# EasyEDA Pro project pickle_risc.epro, board PCB1
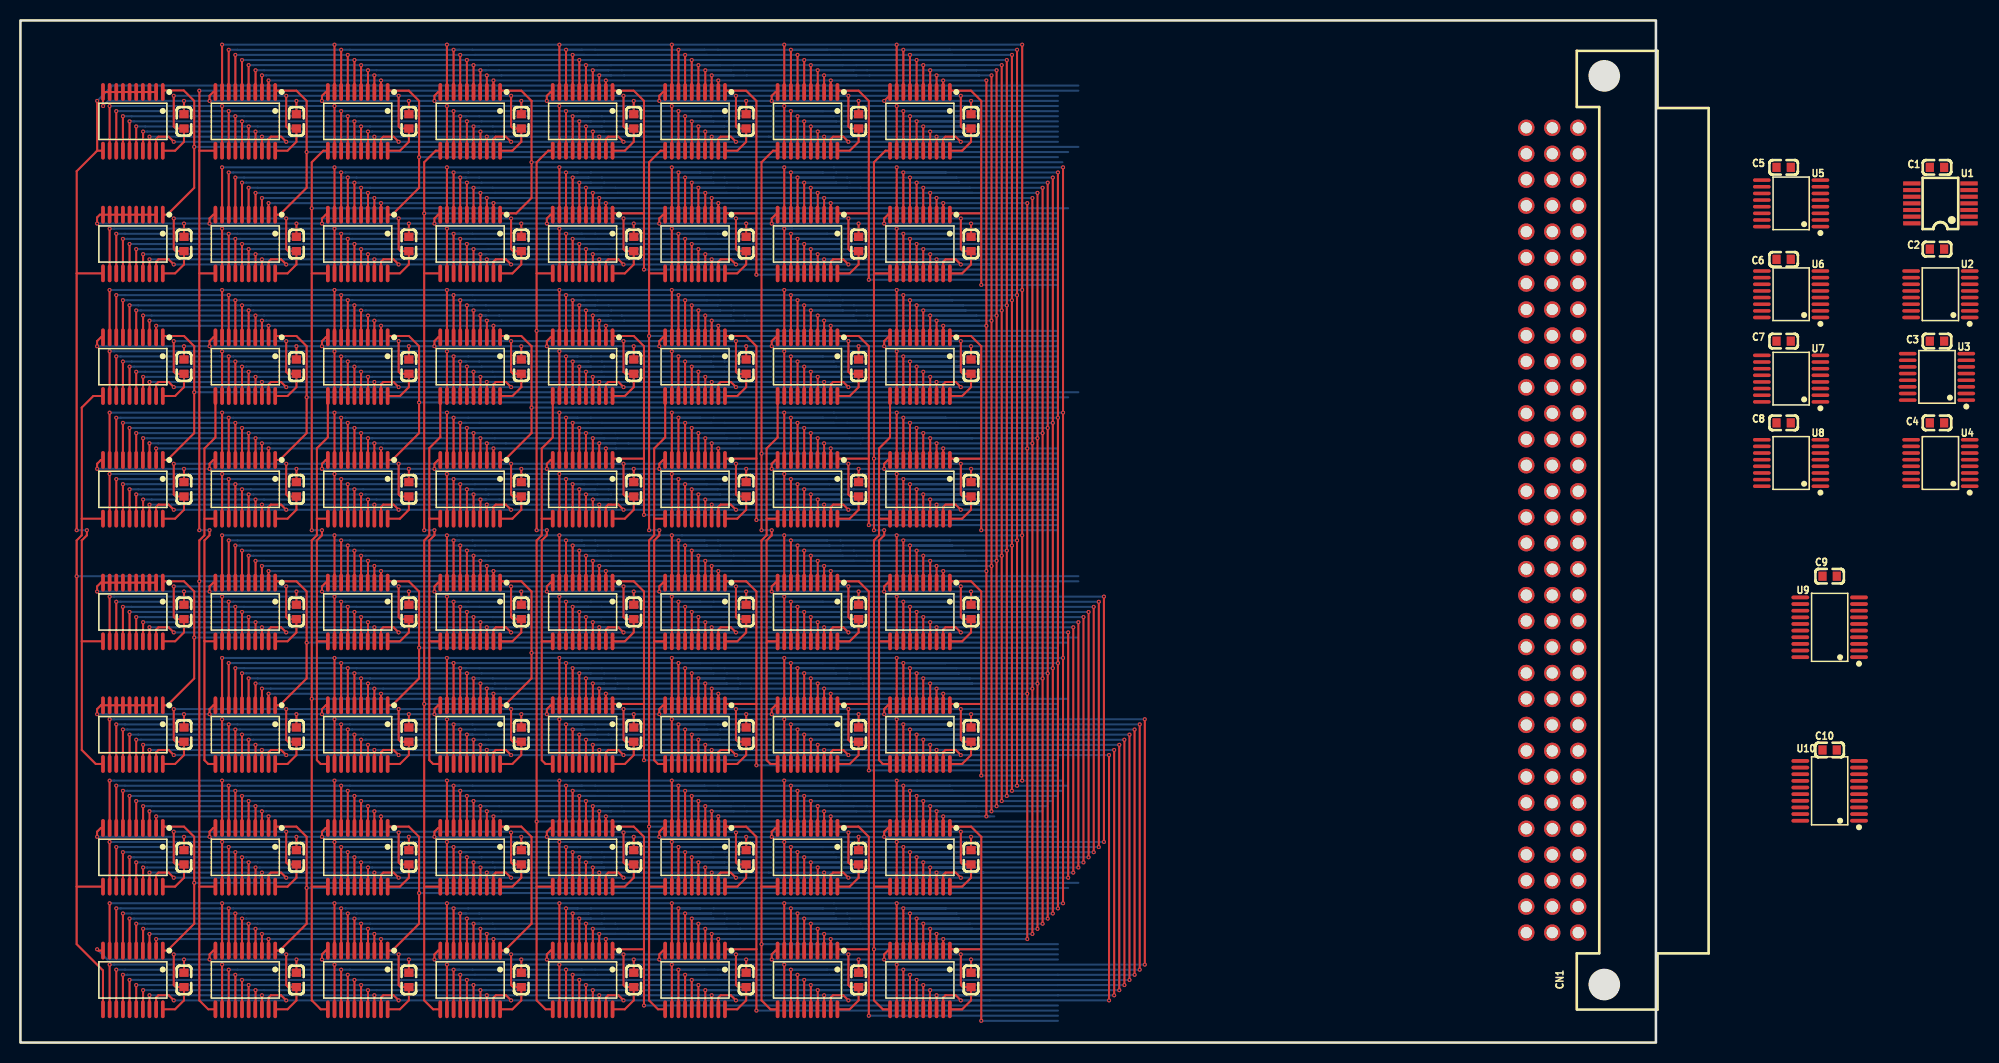
[diagram p1: board, top side]
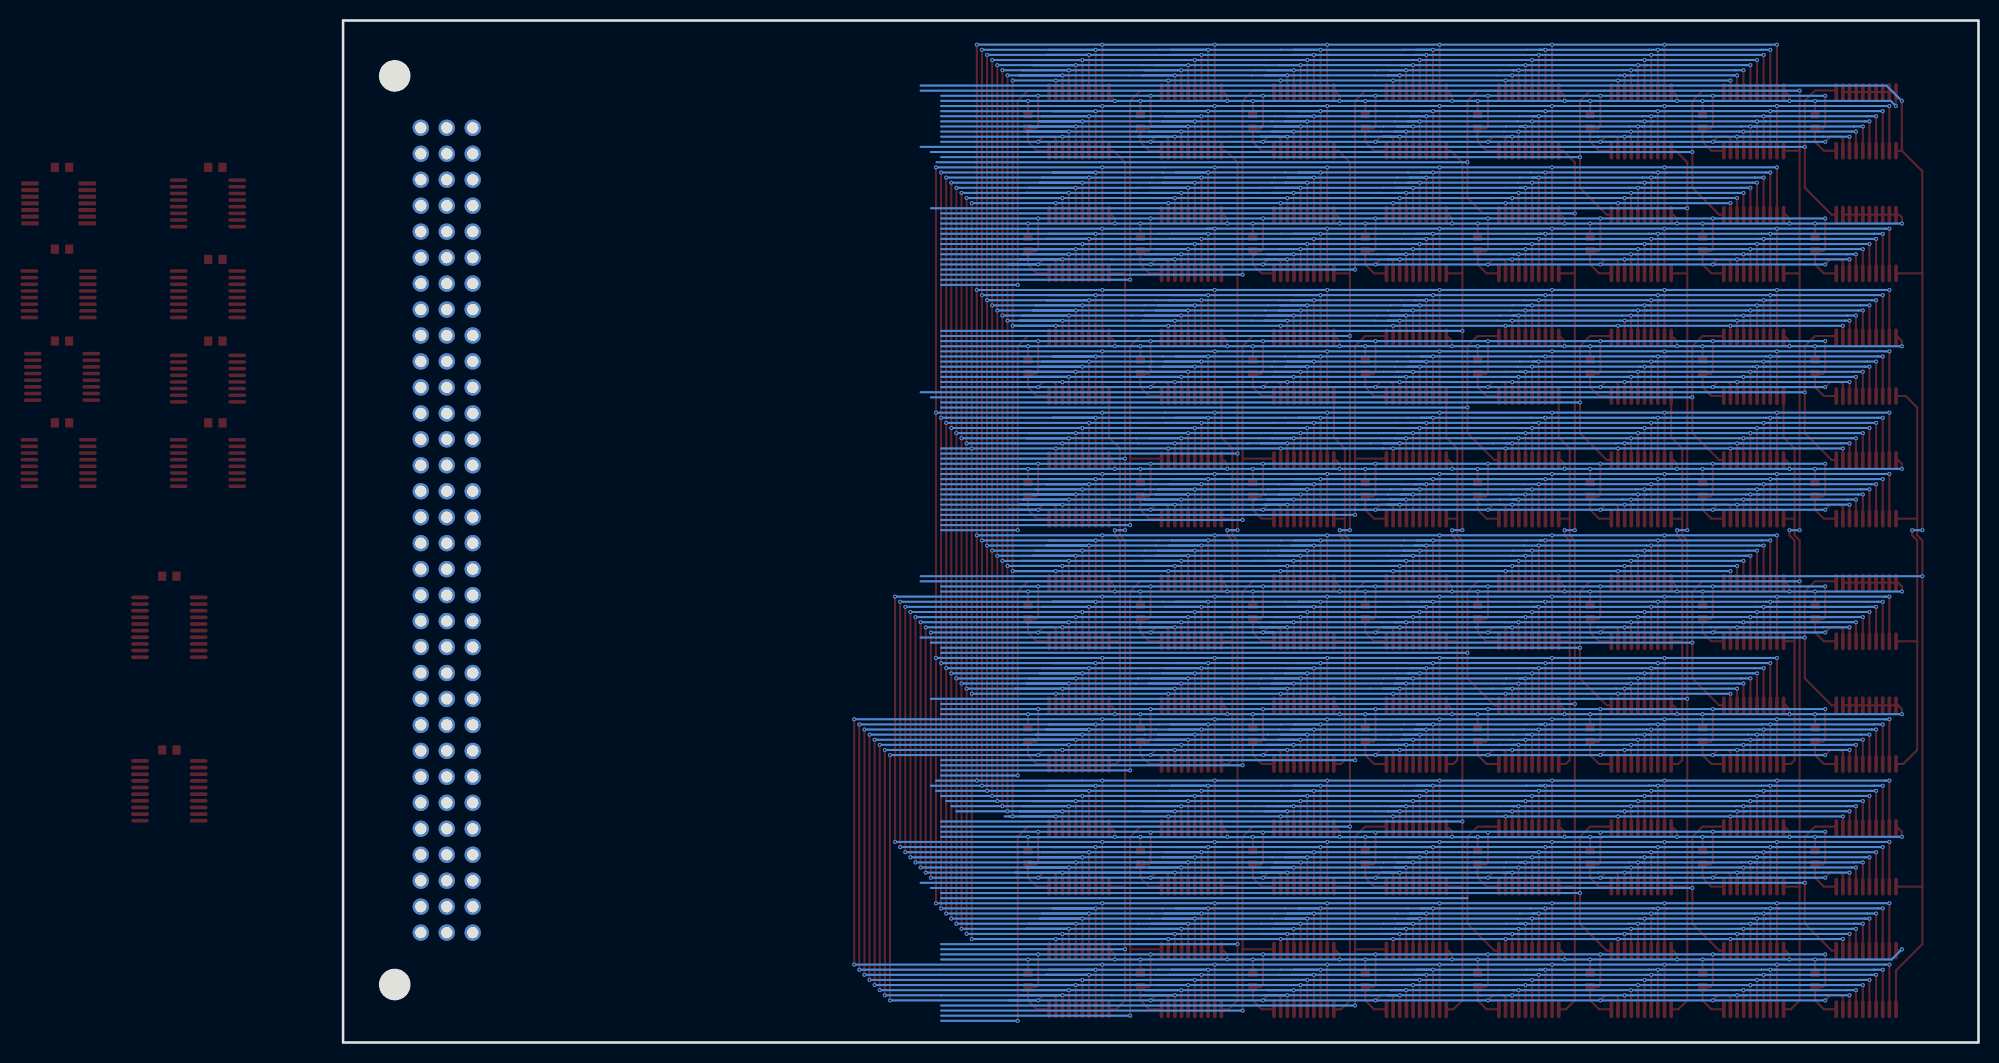
[diagram p2: board, bottom side, seen from below]

Outline 160 x 100 mm; copper layers: Top Layer, Inner1, Inner2, Inner3, Inner4, Inner5, Inner6, Inner7, Inner8, Inner9, Inner10, Inner11, Inner12, Inner13, Inner14, Inner15, Inner16, Inner17, Inner18, Inner19, Inner20, Inner21, Inner22, Inner23, Inner24, Inner25, Inner26, Inner27, Inner28, Inner29, Inner30, Bottom Layer. Coordinates in mm from the lower left corner of the outline.
Outline path: rectangle 0,100 160,0
Stack: Top Layer 0.035mm / Dielectric1 1.51mm FR4 er 4.5 / Bottom Layer 0.035mm

## Design rules (mm)
template: Custom Config
spacing copperThickness1oz (default): track to track 0.102, other pairs 0.152 to 0.3
spacing copperThickness2oz: track to track 0.203, other pairs 0.152 to 0.3
track width copperThickness1oz (default): min 0.127, default 0.2, max 2.54
track width copperThickness2oz: min 0.2, default 0.2, max 2.54
differential pair differentialPair (default): width min 0.127, default 0.254, max 2.54; gap min 0.152, default 0.152
via viaSize (default): diameter min 0.4, default 0.4, max 10; hole min 0.2, default 0.2, max 6.3

## Placement (name value [footprint] x y rotation side)
C1  100nF  [C0603]  187.5 85.63 0 top
C2  100nF  [C0603]  187.5 77.63 0 top
C3  100nF  [C0603]  187.5 68.63 0 top
C4  100nF  [C0603]  187.5 60.63 0 top
C5  100nF  [C0603]  172.5 85.63 180 top
C6  100nF  [C0603]  172.5 76.63 0 top
C7  100nF  [C0603]  172.5 68.63 0 top
C8  100nF  [C0603]  172.5 60.63 0 top
C9  100nF  [C0603]  177 45.63 0 top
C10  100nF  [C0603]  177 28.63 0 top
C13  100nF  [C0603]  27 90.13 90 top
C14  100nF  [C0603]  60 90.13 90 top
C15  100nF  [C0603]  38 90.13 90 top
C16  100nF  [C0603]  49 90.13 90 top
C17  100nF  [C0603]  38 42.13 90 top
C18  100nF  [C0603]  27 30.13 90 top
C19  100nF  [C0603]  27 42.13 90 top
C20  100nF  [C0603]  38 78.13 90 top
C25  100nF  [C0603]  49 30.13 90 top
C26  100nF  [C0603]  49 42.13 90 top
C27  100nF  [C0603]  60 78.13 90 top
C28  100nF  [C0603]  27 78.13 90 top
C29  100nF  [C0603]  60 30.13 90 top
C30  100nF  [C0603]  60 42.13 90 top
C31  100nF  [C0603]  71 78.13 90 top
C32  100nF  [C0603]  71 90.13 90 top
C33  100nF  [C0603]  71 30.13 90 top
C34  100nF  [C0603]  71 42.13 90 top
C35  100nF  [C0603]  82 78.13 90 top
C36  100nF  [C0603]  82 90.13 90 top
C37  100nF  [C0603]  82 30.13 90 top
C38  100nF  [C0603]  82 42.13 90 top
C39  100nF  [C0603]  93 78.13 90 top
C40  100nF  [C0603]  93 90.13 90 top
C41  100nF  [C0603]  93 30.13 90 top
C42  100nF  [C0603]  93 42.13 90 top
C43  100nF  [C0603]  16 54.13 90 top
C44  100nF  [C0603]  16 66.13 90 top
C45  100nF  [C0603]  16 6.13 90 top
C46  100nF  [C0603]  16 18.13 90 top
C47  100nF  [C0603]  27 54.13 90 top
C48  100nF  [C0603]  27 66.13 90 top
C49  100nF  [C0603]  27 6.13 90 top
C50  100nF  [C0603]  27 18.13 90 top
C51  100nF  [C0603]  38 54.13 90 top
C52  100nF  [C0603]  38 66.13 90 top
C53  100nF  [C0603]  38 6.13 90 top
C54  100nF  [C0603]  38 18.13 90 top
C55  100nF  [C0603]  49 54.13 90 top
C56  100nF  [C0603]  49 66.13 90 top
C57  100nF  [C0603]  49 6.13 90 top
C58  100nF  [C0603]  49 18.13 90 top
C59  100nF  [C0603]  60 54.13 90 top
C60  100nF  [C0603]  60 66.13 90 top
C61  100nF  [C0603]  60 6.13 90 top
C62  100nF  [C0603]  60 18.13 90 top
C63  100nF  [C0603]  71 54.13 90 top
C64  100nF  [C0603]  71 66.13 90 top
C65  100nF  [C0603]  71 6.13 90 top
C66  100nF  [C0603]  71 18.13 90 top
C67  100nF  [C0603]  82 54.13 90 top
C68  100nF  [C0603]  82 66.13 90 top
C69  100nF  [C0603]  82 6.13 90 top
C70  100nF  [C0603]  82 18.13 90 top
C71  100nF  [C0603]  93 54.13 90 top
C72  100nF  [C0603]  93 66.13 90 top
C73  100nF  [C0603]  93 6.13 90 top
C74  100nF  [C0603]  93 18.13 90 top
C75  100nF  [C0603]  16 78.13 90 top
C76  100nF  [C0603]  16 90.13 90 top
C77  100nF  [C0603]  16 30.13 90 top
C78  100nF  [C0603]  16 42.13 90 top
C79  100nF  [C0603]  38 30.13 90 top
C80  100nF  [C0603]  49 78.13 90 top
CN1  3511396AMRS0BNA1  [CONN-TH_3511396AMRS0BNA1]  149.86 50.13 90 top
U1  74HC00T14-13  [TSSOP-14_L5.0-W4.4-P0.65-LS6.4-BL]  187.83 82.1 90 top
U2  SN74HC157PWR  [TSSOP-16_L5.0-W4.4-P0.65-LS6.4-BL]  187.83 73.21 90 top
U3  SN74HC138PWR  [TSSOP-16_L5.0-W4.4-P0.65-LS6.4-BL]  187.5 65.13 90 top
U4  SN74HC138PWR  [TSSOP-16_L5.0-W4.4-P0.65-LS6.4-BL]  187.83 56.7 90 top
U5  SN74HC138PWR  [TSSOP-16_L5.0-W4.4-P0.65-LS6.4-BL]  173.23 82.1 90 top
U6  SN74HC138PWR  [TSSOP-16_L5.0-W4.4-P0.65-LS6.4-BL]  173.23 73.21 90 top
U7  SN74HC138PWR  [TSSOP-16_L5.0-W4.4-P0.65-LS6.4-BL]  173.23 64.96 90 top
U8  SN74HC138PWR  [TSSOP-16_L5.0-W4.4-P0.65-LS6.4-BL]  173.23 56.7 90 top
U9  SN74HC574PWR  [TSSOP-20_L6.5-W4.4-P0.65-LS6.4-BL]  177 40.63 90 top
U10  SN74HC574PWR  [TSSOP-20_L6.5-W4.4-P0.65-LS6.4-BL]  177 24.63 90 top
U11  SN74HC574PWR  [TSSOP-20_L6.5-W4.4-P0.65-LS6.4-BL]  55 42.13 180 top
U12  SN74HC574PWR  [TSSOP-20_L6.5-W4.4-P0.65-LS6.4-BL]  66 90.13 180 top
U13  SN74HC574PWR  [TSSOP-20_L6.5-W4.4-P0.65-LS6.4-BL]  22 90.13 180 top
U14  SN74HC574PWR  [TSSOP-20_L6.5-W4.4-P0.65-LS6.4-BL]  55 90.13 180 top
U15  SN74HC574PWR  [TSSOP-20_L6.5-W4.4-P0.65-LS6.4-BL]  33 90.13 180 top
U16  SN74HC574PWR  [TSSOP-20_L6.5-W4.4-P0.65-LS6.4-BL]  44 90.13 180 top
U17  SN74HC574PWR  [TSSOP-20_L6.5-W4.4-P0.65-LS6.4-BL]  22 42.13 180 top
U18  SN74HC574PWR  [TSSOP-20_L6.5-W4.4-P0.65-LS6.4-BL]  22 30.13 180 top
U19  SN74HC574PWR  [TSSOP-20_L6.5-W4.4-P0.65-LS6.4-BL]  77 90.13 180 top
U20  SN74HC574PWR  [TSSOP-20_L6.5-W4.4-P0.65-LS6.4-BL]  88 90.13 180 top
U21  SN74HC574PWR  [TSSOP-20_L6.5-W4.4-P0.65-LS6.4-BL]  33 30.13 180 top
U22  SN74HC574PWR  [TSSOP-20_L6.5-W4.4-P0.65-LS6.4-BL]  33 42.13 180 top
U23  SN74HC574PWR  [TSSOP-20_L6.5-W4.4-P0.65-LS6.4-BL]  33 66.13 180 top
U24  SN74HC574PWR  [TSSOP-20_L6.5-W4.4-P0.65-LS6.4-BL]  44 66.13 180 top
U25  SN74HC574PWR  [TSSOP-20_L6.5-W4.4-P0.65-LS6.4-BL]  44 30.13 180 top
U26  SN74HC574PWR  [TSSOP-20_L6.5-W4.4-P0.65-LS6.4-BL]  44 42.13 180 top
U27  SN74HC574PWR  [TSSOP-20_L6.5-W4.4-P0.65-LS6.4-BL]  77 66.13 180 top
U28  SN74HC574PWR  [TSSOP-20_L6.5-W4.4-P0.65-LS6.4-BL]  88 66.13 180 top
U29  SN74HC574PWR  [TSSOP-20_L6.5-W4.4-P0.65-LS6.4-BL]  55 30.13 180 top
U30  SN74HC574PWR  [TSSOP-20_L6.5-W4.4-P0.65-LS6.4-BL]  22 78.13 180 top
U31  SN74HC574PWR  [TSSOP-20_L6.5-W4.4-P0.65-LS6.4-BL]  33 78.13 180 top
U32  SN74HC574PWR  [TSSOP-20_L6.5-W4.4-P0.65-LS6.4-BL]  44 78.13 180 top
U33  SN74HC574PWR  [TSSOP-20_L6.5-W4.4-P0.65-LS6.4-BL]  55 78.13 180 top
U34  SN74HC574PWR  [TSSOP-20_L6.5-W4.4-P0.65-LS6.4-BL]  66 78.13 180 top
U35  SN74HC574PWR  [TSSOP-20_L6.5-W4.4-P0.65-LS6.4-BL]  77 78.13 180 top
U36  SN74HC574PWR  [TSSOP-20_L6.5-W4.4-P0.65-LS6.4-BL]  88 78.13 180 top
U37  SN74HC574PWR  [TSSOP-20_L6.5-W4.4-P0.65-LS6.4-BL]  77 30.13 180 top
U38  SN74HC574PWR  [TSSOP-20_L6.5-W4.4-P0.65-LS6.4-BL]  77 42.13 180 top
U39  SN74HC574PWR  [TSSOP-20_L6.5-W4.4-P0.65-LS6.4-BL]  33 54.13 180 top
U40  SN74HC574PWR  [TSSOP-20_L6.5-W4.4-P0.65-LS6.4-BL]  44 54.13 180 top
U41  SN74HC574PWR  [TSSOP-20_L6.5-W4.4-P0.65-LS6.4-BL]  88 30.13 180 top
U42  SN74HC574PWR  [TSSOP-20_L6.5-W4.4-P0.65-LS6.4-BL]  88 42.13 180 top
U43  SN74HC574PWR  [TSSOP-20_L6.5-W4.4-P0.65-LS6.4-BL]  77 54.13 180 top
U44  SN74HC574PWR  [TSSOP-20_L6.5-W4.4-P0.65-LS6.4-BL]  88 54.13 180 top
U45  SN74HC574PWR  [TSSOP-20_L6.5-W4.4-P0.65-LS6.4-BL]  11 6.13 180 top
U46  SN74HC574PWR  [TSSOP-20_L6.5-W4.4-P0.65-LS6.4-BL]  11 18.13 180 top
U47  SN74HC574PWR  [TSSOP-20_L6.5-W4.4-P0.65-LS6.4-BL]  66 42.13 180 top
U48  SN74HC574PWR  [TSSOP-20_L6.5-W4.4-P0.65-LS6.4-BL]  66 30.13 180 top
U49  SN74HC574PWR  [TSSOP-20_L6.5-W4.4-P0.65-LS6.4-BL]  22 6.13 180 top
U50  SN74HC574PWR  [TSSOP-20_L6.5-W4.4-P0.65-LS6.4-BL]  22 18.13 180 top
U51  SN74HC574PWR  [TSSOP-20_L6.5-W4.4-P0.65-LS6.4-BL]  11 54.13 180 top
U52  SN74HC574PWR  [TSSOP-20_L6.5-W4.4-P0.65-LS6.4-BL]  11 66.13 180 top
U53  SN74HC574PWR  [TSSOP-20_L6.5-W4.4-P0.65-LS6.4-BL]  33 6.13 180 top
U54  SN74HC574PWR  [TSSOP-20_L6.5-W4.4-P0.65-LS6.4-BL]  33 18.13 180 top
U55  SN74HC574PWR  [TSSOP-20_L6.5-W4.4-P0.65-LS6.4-BL]  22 54.13 180 top
U56  SN74HC574PWR  [TSSOP-20_L6.5-W4.4-P0.65-LS6.4-BL]  22 66.13 180 top
U57  SN74HC574PWR  [TSSOP-20_L6.5-W4.4-P0.65-LS6.4-BL]  44 6.13 180 top
U58  SN74HC574PWR  [TSSOP-20_L6.5-W4.4-P0.65-LS6.4-BL]  44 18.13 180 top
U59  SN74HC574PWR  [TSSOP-20_L6.5-W4.4-P0.65-LS6.4-BL]  55 54.13 180 top
U60  SN74HC574PWR  [TSSOP-20_L6.5-W4.4-P0.65-LS6.4-BL]  55 66.13 180 top
U61  SN74HC574PWR  [TSSOP-20_L6.5-W4.4-P0.65-LS6.4-BL]  55 6.13 180 top
U62  SN74HC574PWR  [TSSOP-20_L6.5-W4.4-P0.65-LS6.4-BL]  55 18.13 180 top
U63  SN74HC574PWR  [TSSOP-20_L6.5-W4.4-P0.65-LS6.4-BL]  66 54.13 180 top
U64  SN74HC574PWR  [TSSOP-20_L6.5-W4.4-P0.65-LS6.4-BL]  66 66.13 180 top
U65  SN74HC574PWR  [TSSOP-20_L6.5-W4.4-P0.65-LS6.4-BL]  66 6.13 180 top
U66  SN74HC574PWR  [TSSOP-20_L6.5-W4.4-P0.65-LS6.4-BL]  66 18.13 180 top
U67  SN74HC574PWR  [TSSOP-20_L6.5-W4.4-P0.65-LS6.4-BL]  11 78.13 180 top
U68  SN74HC574PWR  [TSSOP-20_L6.5-W4.4-P0.65-LS6.4-BL]  11 90.13 180 top
U69  SN74HC574PWR  [TSSOP-20_L6.5-W4.4-P0.65-LS6.4-BL]  77 6.13 180 top
U70  SN74HC574PWR  [TSSOP-20_L6.5-W4.4-P0.65-LS6.4-BL]  77 18.13 180 top
U71  SN74HC574PWR  [TSSOP-20_L6.5-W4.4-P0.65-LS6.4-BL]  11 42.13 180 top
U72  SN74HC574PWR  [TSSOP-20_L6.5-W4.4-P0.65-LS6.4-BL]  11 30.13 180 top
U73  SN74HC574PWR  [TSSOP-20_L6.5-W4.4-P0.65-LS6.4-BL]  88 6.13 180 top
U74  SN74HC574PWR  [TSSOP-20_L6.5-W4.4-P0.65-LS6.4-BL]  88 18.13 180 top

## Footprints (pads in the part's own frame, mm; a bottom-side part is the same pattern mirrored in y, then rotated)
C0603
  rect 0.8x0.9 smd: 1(-0.7,0) 2(0.7,0)
CONN-TH_3511396AMRS0BNA1
  round 1.6 hole 1.1: A1(39.37,-2.54) A2(36.83,-2.54) A3(34.29,-2.54) A4(31.75,-2.54) A5(29.21,-2.54) A6(26.67,-2.54) A7(24.13,-2.54) A8(21.59,-2.54) A9(19.05,-2.54) A10(16.51,-2.54) A11(13.97,-2.54) A12(11.43,-2.54) A13(8.89,-2.54) A14(6.35,-2.54) A15(3.81,-2.54) A16(1.27,-2.54) A17(-1.27,-2.54) A18(-3.81,-2.54) A19(-6.35,-2.54) A20(-8.89,-2.54) A21(-11.43,-2.54) A22(-13.97,-2.54) A23(-16.51,-2.54) A24(-19.05,-2.54) A25(-21.59,-2.54) A26(-24.13,-2.54) A27(-26.67,-2.54) A28(-29.21,-2.54) A29(-31.75,-2.54) A30(-34.29,-2.54) A31(-36.83,-2.54) A32(-39.37,-2.54) B1(39.37,0) B2(36.83,0) B3(34.29,0) B4(31.75,0) B5(29.21,0) B6(26.67,0) B7(24.13,0) B8(21.59,0) B9(19.05,0) B10(16.51,0) B11(13.97,0) B12(11.43,0) B13(8.89,0) B14(6.35,0) B15(3.81,0) B16(1.27,0) B17(-1.27,0) B18(-3.81,0) B19(-6.35,0) B20(-8.89,0) B21(-11.43,0) B22(-13.97,0) B23(-16.51,0) B24(-19.05,0) B25(-21.59,0) B26(-24.13,0) B27(-26.67,0) B28(-29.21,0) B29(-31.75,0) B30(-34.29,0) B31(-36.83,0) B32(-39.37,0) C1(39.37,2.54) C2(36.83,2.54) C3(34.29,2.54) C4(31.75,2.54) C5(29.21,2.54) C6(26.67,2.54) C7(24.13,2.54) C8(21.59,2.54) C9(19.05,2.54) C10(16.51,2.54) C11(13.97,2.54) C12(11.43,2.54) C13(8.89,2.54) C14(6.35,2.54) C15(3.81,2.54) C16(1.27,2.54) C17(-1.27,2.54) C18(-3.81,2.54) C19(-6.35,2.54) C20(-8.89,2.54) C21(-11.43,2.54) C22(-13.97,2.54) C23(-16.51,2.54) C24(-19.05,2.54) C25(-21.59,2.54) C26(-24.13,2.54) C27(-26.67,2.54) C28(-29.21,2.54) C29(-31.75,2.54) C30(-34.29,2.54) C31(-36.83,2.54) C32(-39.37,2.54)
TSSOP-14_L5.0-W4.4-P0.65-LS6.4-BL
  rect 0.4x1.7 smd: 1(-1.95,-2.8) 2(-1.3,-2.8) 3(-0.65,-2.8) 4(0,-2.8) 5(0.65,-2.8) 6(1.3,-2.8) 7(1.95,-2.8) 8(1.95,2.8) 9(1.3,2.8) 10(0.65,2.8) 11(0,2.8) 12(-0.65,2.8) 13(-1.3,2.8) 14(-1.95,2.8)
TSSOP-16_L5.0-W4.4-P0.65-LS6.4-BL
  oval 0.343x1.732 smd: 1(-2.275,-2.866) 2(-1.625,-2.866) 3(-0.975,-2.866) 4(-0.325,-2.866) 5(0.325,-2.866) 6(0.975,-2.866) 7(1.625,-2.866) 8(2.275,-2.866) 9(2.275,2.866) 10(1.625,2.866) 11(0.975,2.866) 12(0.325,2.866) 13(-0.325,2.866) 14(-0.975,2.866) 15(-1.625,2.866) 16(-2.275,2.866)
TSSOP-20_L6.5-W4.4-P0.65-LS6.4-BL
  oval 0.364x1.742 smd: 1(-2.925,-2.871) 2(-2.275,-2.871) 3(-1.625,-2.871) 4(-0.975,-2.871) 5(-0.325,-2.871) 6(0.325,-2.871) 7(0.975,-2.871) 8(1.625,-2.871) 9(2.275,-2.871) 10(2.925,-2.871) 11(2.925,2.871) 12(2.275,2.871) 13(1.625,2.871) 14(0.975,2.871) 15(0.325,2.871) 16(-0.325,2.871) 17(-0.975,2.871) 18(-1.625,2.871) 19(-2.275,2.871) 20(-2.925,2.871)

## Nets
GND: C1.2 C2.2 C3.2 C4.2 C5.2 C6.2 C7.2 C8.2 C9.2 C10.2 C13.2 C14.2 C15.2 C16.2 C17.2 C18.2 C19.2 C20.2 C25.2 C26.2 C27.2 C28.2 C29.2 C30.2 C31.2 C32.2 C33.2 C34.2 C35.2 C36.2 C37.2 C38.2 C39.2 C40.2 C41.2 C42.2 C43.2 C44.2 C45.2 C46.2 C47.2 C48.2 C49.2 C50.2 C51.2 C52.2 C53.2 C54.2 C55.2 C56.2 C57.2 C58.2 C59.2 C60.2 C61.2 C62.2 C63.2 C64.2 C65.2 C66.2 C67.2 C68.2 C69.2 C70.2 C71.2 C72.2 C73.2 C74.2 C75.2 C76.2 C77.2 C78.2 C79.2 C80.2 CN1.B3 CN1.B6 CN1.B9 CN1.B12 CN1.B15 CN1.B18 CN1.B21 CN1.B24 CN1.B27 CN1.B30 U1.7 U1.12 U1.13 U2.8 U3.4 U3.8 U4.8 U5.4 U5.8 U6.8 U7.8 U8.8 U9.1 U9.10 U10.1 U10.10 U11.10 U12.10 U13.10 U14.10 U15.10 U16.10 U17.10 U18.10 U19.10 U20.10 U21.10 U22.10 U23.10 U24.10 U25.10 U26.10 U27.10 U28.10 U29.10 U30.10 U31.10 U32.10 U33.10 U34.10 U35.10 U36.10 U37.10 U38.10 U39.10 U40.10 U41.10 U42.10 U43.10 U44.10 U45.10 U46.10 U47.10 U48.10 U49.10 U50.10 U51.10 U52.10 U53.10 U54.10 U55.10 U56.10 U57.10 U58.10 U59.10 U60.10 U61.10 U62.10 U63.10 U64.10 U65.10 U66.10 U67.2 U67.3 U67.4 U67.5 U67.6 U67.7 U67.8 U67.9 U67.10 U68.2 U68.3 U68.4 U68.5 U68.6 U68.7 U68.8 U68.9 U68.10 U69.10 U70.10 U71.2 U71.3 U71.4 U71.5 U71.6 U71.7 U71.8 U71.9 U71.10 U72.2 U72.3 U72.4 U72.5 U72.6 U72.7 U72.8 U72.9 U72.10 U73.10 U74.10
VCC: C1.1 C2.1 C3.1 C4.1 C5.1 C6.1 C7.1 C8.1 C9.1 C10.1 C13.1 C14.1 C15.1 C16.1 C17.1 C18.1 C19.1 C20.1 C25.1 C26.1 C27.1 C28.1 C29.1 C30.1 C31.1 C32.1 C33.1 C34.1 C35.1 C36.1 C37.1 C38.1 C39.1 C40.1 C41.1 C42.1 C43.1 C44.1 C45.1 C46.1 C47.1 C48.1 C49.1 C50.1 C51.1 C52.1 C53.1 C54.1 C55.1 C56.1 C57.1 C58.1 C59.1 C60.1 C61.1 C62.1 C63.1 C64.1 C65.1 C66.1 C67.1 C68.1 C69.1 C70.1 C71.1 C72.1 C73.1 C74.1 C75.1 C76.1 C77.1 C78.1 C79.1 C80.1 CN1.A1 CN1.B1 CN1.C1 U1.14 U2.16 U3.16 U4.6 U4.16 U5.16 U6.6 U6.16 U7.16 U8.16 U9.20 U10.20 U11.20 U12.20 U13.20 U14.20 U15.20 U16.20 U17.20 U18.20 U19.20 U20.20 U21.20 U22.20 U23.20 U24.20 U25.20 U26.20 U27.20 U28.20 U29.20 U30.20 U31.20 U32.20 U33.20 U34.20 U35.20 U36.20 U37.20 U38.20 U39.20 U40.20 U41.20 U42.20 U43.20 U44.20 U45.20 U46.20 U47.20 U48.20 U49.20 U50.20 U51.20 U52.20 U53.20 U54.20 U55.20 U56.20 U57.20 U58.20 U59.20 U60.20 U61.20 U62.20 U63.20 U64.20 U65.20 U66.20 U67.20 U68.20 U69.20 U70.20 U71.20 U72.20 U73.20 U74.20
A0: CN1.A17 U12.19 U13.19 U14.19 U15.19 U16.19 U19.19 U20.19 U23.19 U24.19 U27.19 U28.19 U52.19 U56.19 U60.19 U64.19 U68.19
A1: CN1.A18 U12.18 U13.18 U14.18 U15.18 U16.18 U19.18 U20.18 U23.18 U24.18 U27.18 U28.18 U52.18 U56.18 U60.18 U64.18 U68.18
A2: CN1.A19 U12.17 U13.17 U14.17 U15.17 U16.17 U19.17 U20.17 U23.17 U24.17 U27.17 U28.17 U52.17 U56.17 U60.17 U64.17 U68.17
A3: CN1.A20 U12.16 U13.16 U14.16 U15.16 U16.16 U19.16 U20.16 U23.16 U24.16 U27.16 U28.16 U52.16 U56.16 U60.16 U64.16 U68.16
A4: CN1.A21 U12.15 U13.15 U14.15 U15.15 U16.15 U19.15 U20.15 U23.15 U24.15 U27.15 U28.15 U52.15 U56.15 U60.15 U64.15 U68.15
A5: CN1.A22 U12.14 U13.14 U14.14 U15.14 U16.14 U19.14 U20.14 U23.14 U24.14 U27.14 U28.14 U52.14 U56.14 U60.14 U64.14 U68.14
A6: CN1.A23 U12.13 U13.13 U14.13 U15.13 U16.13 U19.13 U20.13 U23.13 U24.13 U27.13 U28.13 U52.13 U56.13 U60.13 U64.13 U68.13
A7: CN1.A24 U12.12 U13.12 U14.12 U15.12 U16.12 U19.12 U20.12 U23.12 U24.12 U27.12 U28.12 U52.12 U56.12 U60.12 U64.12 U68.12
A8: CN1.A25 U30.19 U31.19 U32.19 U33.19 U34.19 U35.19 U36.19 U39.19 U40.19 U43.19 U44.19 U51.19 U55.19 U59.19 U63.19 U67.19
A9: CN1.A26 U30.18 U31.18 U32.18 U33.18 U34.18 U35.18 U36.18 U39.18 U40.18 U43.18 U44.18 U51.18 U55.18 U59.18 U63.18 U67.18
A10: CN1.A27 U30.17 U31.17 U32.17 U33.17 U34.17 U35.17 U36.17 U39.17 U40.17 U43.17 U44.17 U51.17 U55.17 U59.17 U63.17 U67.17
A11: CN1.A28 U30.16 U31.16 U32.16 U33.16 U34.16 U35.16 U36.16 U39.16 U40.16 U43.16 U44.16 U51.16 U55.16 U59.16 U63.16 U67.16
A12: CN1.A29 U30.15 U31.15 U32.15 U33.15 U34.15 U35.15 U36.15 U39.15 U40.15 U43.15 U44.15 U51.15 U55.15 U59.15 U63.15 U67.15
A13: CN1.A30 U30.14 U31.14 U32.14 U33.14 U34.14 U35.14 U36.14 U39.14 U40.14 U43.14 U44.14 U51.14 U55.14 U59.14 U63.14 U67.14
A14: CN1.A31 U30.13 U31.13 U32.13 U33.13 U34.13 U35.13 U36.13 U39.13 U40.13 U43.13 U44.13 U51.13 U55.13 U59.13 U63.13 U67.13
A15: CN1.A32 U30.12 U31.12 U32.12 U33.12 U34.12 U35.12 U36.12 U39.12 U40.12 U43.12 U44.12 U51.12 U55.12 U59.12 U63.12 U67.12
A_MODE0: CN1.A2 U1.10 U2.15
A_MODE1: CN1.A3 U1.4 U1.5 U2.1
A_SEL0: CN1.C5 U2.2
A_SEL1: CN1.C4 U2.5
A_SEL2: CN1.C3 U2.14
A_SEL3: CN1.C2 U2.11
AD_SEL0: U2.4 U5.1 U6.1
AD_SEL1: U2.7 U5.2 U6.2
AD_SEL2: U2.12 U5.3 U6.3
AD_SEL3: U2.9 U5.6 U6.4
B0: U11.19 U17.19 U22.19 U26.19 U38.19 U42.19 U46.19 U47.19 U50.19 U54.19 U58.19 U62.19 U66.19 U70.19 U71.19 U74.19
B1: U11.18 U17.18 U22.18 U26.18 U38.18 U42.18 U46.18 U47.18 U50.18 U54.18 U58.18 U62.18 U66.18 U70.18 U71.18 U74.18
B2: U11.17 U17.17 U22.17 U26.17 U38.17 U42.17 U46.17 U47.17 U50.17 U54.17 U58.17 U62.17 U66.17 U70.17 U71.17 U74.17
B3: U11.16 U17.16 U22.16 U26.16 U38.16 U42.16 U46.16 U47.16 U50.16 U54.16 U58.16 U62.16 U66.16 U70.16 U71.16 U74.16
B4: U11.15 U17.15 U22.15 U26.15 U38.15 U42.15 U46.15 U47.15 U50.15 U54.15 U58.15 U62.15 U66.15 U70.15 U71.15 U74.15
B5: U11.14 U17.14 U22.14 U26.14 U38.14 U42.14 U46.14 U47.14 U50.14 U54.14 U58.14 U62.14 U66.14 U70.14 U71.14 U74.14
B6: U11.13 U17.13 U22.13 U26.13 U38.13 U42.13 U46.13 U47.13 U50.13 U54.13 U58.13 U62.13 U66.13 U70.13 U71.13 U74.13
B7: U11.12 U17.12 U22.12 U26.12 U38.12 U42.12 U46.12 U47.12 U50.12 U54.12 U58.12 U62.12 U66.12 U70.12 U71.12 U74.12
B8: U18.19 U21.19 U25.19 U29.19 U37.19 U41.19 U45.19 U48.19 U49.19 U53.19 U57.19 U61.19 U65.19 U69.19 U72.19 U73.19
B9: U18.18 U21.18 U25.18 U29.18 U37.18 U41.18 U45.18 U48.18 U49.18 U53.18 U57.18 U61.18 U65.18 U69.18 U72.18 U73.18
B10: U18.17 U21.17 U25.17 U29.17 U37.17 U41.17 U45.17 U48.17 U49.17 U53.17 U57.17 U61.17 U65.17 U69.17 U72.17 U73.17
B11: U18.16 U21.16 U25.16 U29.16 U37.16 U41.16 U45.16 U48.16 U49.16 U53.16 U57.16 U61.16 U65.16 U69.16 U72.16 U73.16
B12: U18.15 U21.15 U25.15 U29.15 U37.15 U41.15 U45.15 U48.15 U49.15 U53.15 U57.15 U61.15 U65.15 U69.15 U72.15 U73.15
B13: U18.14 U21.14 U25.14 U29.14 U37.14 U41.14 U45.14 U48.14 U49.14 U53.14 U57.14 U61.14 U65.14 U69.14 U72.14 U73.14
B14: U18.13 U21.13 U25.13 U29.13 U37.13 U41.13 U45.13 U48.13 U49.13 U53.13 U57.13 U61.13 U65.13 U69.13 U72.13 U73.13
B15: U18.12 U21.12 U25.12 U29.12 U37.12 U41.12 U45.12 U48.12 U49.12 U53.12 U57.12 U61.12 U65.12 U69.12 U72.12 U73.12
B_SEL0: CN1.C9 U3.1 U4.1
B_SEL1: CN1.C8 U3.2 U4.2
B_SEL2: CN1.C7 U3.3 U4.3
B_SEL3: CN1.C6 U3.6 U4.4
CLK: U7.6 U8.6 U9.11 U10.11
D0: CN1.C17 U9.9
D1: CN1.C18 U9.8
D2: CN1.C19 U9.7
D3: CN1.C20 U9.6
D4: CN1.C21 U9.5
D5: CN1.C22 U9.4
D6: CN1.C23 U9.3
D7: CN1.C24 U9.2
D8: CN1.C25 U10.9
D9: CN1.C26 U10.8
D10: CN1.C27 U10.7
D11: CN1.C28 U10.6
D12: CN1.C29 U10.5
D13: CN1.C30 U10.4
D14: CN1.C31 U10.3
D15: CN1.C32 U10.2
D_LATCHED0: U10.19 U11.2 U12.2 U13.2 U14.2 U15.2 U16.2 U17.2 U19.2 U20.2 U22.2 U23.2 U24.2 U26.2 U27.2 U28.2 U38.2 U42.2 U46.2 U47.2 U50.2 U52.2 U54.2 U56.2 U58.2 U60.2 U62.2 U64.2 U66.2 U70.2 U74.2
D_LATCHED1: U10.18 U11.3 U12.3 U13.3 U14.3 U15.3 U16.3 U17.3 U19.3 U20.3 U22.3 U23.3 U24.3 U26.3 U27.3 U28.3 U38.3 U42.3 U46.3 U47.3 U50.3 U52.3 U54.3 U56.3 U58.3 U60.3 U62.3 U64.3 U66.3 U70.3 U74.3
D_LATCHED2: U10.17 U11.4 U12.4 U13.4 U14.4 U15.4 U16.4 U17.4 U19.4 U20.4 U22.4 U23.4 U24.4 U26.4 U27.4 U28.4 U38.4 U42.4 U46.4 U47.4 U50.4 U52.4 U54.4 U56.4 U58.4 U60.4 U62.4 U64.4 U66.4 U70.4 U74.4
D_LATCHED3: U10.16 U11.5 U12.5 U13.5 U14.5 U15.5 U16.5 U17.5 U19.5 U20.5 U22.5 U23.5 U24.5 U26.5 U27.5 U28.5 U38.5 U42.5 U46.5 U47.5 U50.5 U52.5 U54.5 U56.5 U58.5 U60.5 U62.5 U64.5 U66.5 U70.5 U74.5
D_LATCHED4: U10.15 U11.6 U12.6 U13.6 U14.6 U15.6 U16.6 U17.6 U19.6 U20.6 U22.6 U23.6 U24.6 U26.6 U27.6 U28.6 U38.6 U42.6 U46.6 U47.6 U50.6 U52.6 U54.6 U56.6 U58.6 U60.6 U62.6 U64.6 U66.6 U70.6 U74.6
D_LATCHED5: U10.14 U11.7 U12.7 U13.7 U14.7 U15.7 U16.7 U17.7 U19.7 U20.7 U22.7 U23.7 U24.7 U26.7 U27.7 U28.7 U38.7 U42.7 U46.7 U47.7 U50.7 U52.7 U54.7 U56.7 U58.7 U60.7 U62.7 U64.7 U66.7 U70.7 U74.7
D_LATCHED6: U10.13 U11.8 U12.8 U13.8 U14.8 U15.8 U16.8 U17.8 U19.8 U20.8 U22.8 U23.8 U24.8 U26.8 U27.8 U28.8 U38.8 U42.8 U46.8 U47.8 U50.8 U52.8 U54.8 U56.8 U58.8 U60.8 U62.8 U64.8 U66.8 U70.8 U74.8
D_LATCHED7: U10.12 U11.9 U12.9 U13.9 U14.9 U15.9 U16.9 U17.9 U19.9 U20.9 U22.9 U23.9 U24.9 U26.9 U27.9 U28.9 U38.9 U42.9 U46.9 U47.9 U50.9 U52.9 U54.9 U56.9 U58.9 U60.9 U62.9 U64.9 U66.9 U70.9 U74.9
D_LATCHED8: U9.19 U18.2 U21.2 U25.2 U29.2 U30.2 U31.2 U32.2 U33.2 U34.2 U35.2 U36.2 U37.2 U39.2 U40.2 U41.2 U43.2 U44.2 U45.2 U48.2 U49.2 U51.2 U53.2 U55.2 U57.2 U59.2 U61.2 U63.2 U65.2 U69.2 U73.2
D_LATCHED9: U9.18 U18.3 U21.3 U25.3 U29.3 U30.3 U31.3 U32.3 U33.3 U34.3 U35.3 U36.3 U37.3 U39.3 U40.3 U41.3 U43.3 U44.3 U45.3 U48.3 U49.3 U51.3 U53.3 U55.3 U57.3 U59.3 U61.3 U63.3 U65.3 U69.3 U73.3
D_LATCHED10: U9.17 U18.4 U21.4 U25.4 U29.4 U30.4 U31.4 U32.4 U33.4 U34.4 U35.4 U36.4 U37.4 U39.4 U40.4 U41.4 U43.4 U44.4 U45.4 U48.4 U49.4 U51.4 U53.4 U55.4 U57.4 U59.4 U61.4 U63.4 U65.4 U69.4 U73.4
D_LATCHED11: U9.16 U18.5 U21.5 U25.5 U29.5 U30.5 U31.5 U32.5 U33.5 U34.5 U35.5 U36.5 U37.5 U39.5 U40.5 U41.5 U43.5 U44.5 U45.5 U48.5 U49.5 U51.5 U53.5 U55.5 U57.5 U59.5 U61.5 U63.5 U65.5 U69.5 U73.5
D_LATCHED12: U9.15 U18.6 U21.6 U25.6 U29.6 U30.6 U31.6 U32.6 U33.6 U34.6 U35.6 U36.6 U37.6 U39.6 U40.6 U41.6 U43.6 U44.6 U45.6 U48.6 U49.6 U51.6 U53.6 U55.6 U57.6 U59.6 U61.6 U63.6 U65.6 U69.6 U73.6
D_LATCHED13: U9.14 U18.7 U21.7 U25.7 U29.7 U30.7 U31.7 U32.7 U33.7 U34.7 U35.7 U36.7 U37.7 U39.7 U40.7 U41.7 U43.7 U44.7 U45.7 U48.7 U49.7 U51.7 U53.7 U55.7 U57.7 U59.7 U61.7 U63.7 U65.7 U69.7 U73.7
D_LATCHED14: U9.13 U18.8 U21.8 U25.8 U29.8 U30.8 U31.8 U32.8 U33.8 U34.8 U35.8 U36.8 U37.8 U39.8 U40.8 U41.8 U43.8 U44.8 U45.8 U48.8 U49.8 U51.8 U53.8 U55.8 U57.8 U59.8 U61.8 U63.8 U65.8 U69.8 U73.8
D_LATCHED15: U9.12 U18.9 U21.9 U25.9 U29.9 U30.9 U31.9 U32.9 U33.9 U34.9 U35.9 U36.9 U37.9 U39.9 U40.9 U41.9 U43.9 U44.9 U45.9 U48.9 U49.9 U51.9 U53.9 U55.9 U57.9 U59.9 U61.9 U63.9 U65.9 U69.9 U73.9
D_SEL0: CN1.B7 U2.3 U7.1 U8.1
D_SEL1: CN1.B5 U2.6 U7.2 U8.2
D_SEL2: CN1.B4 U2.13 U7.3 U8.3
D_SEL3: CN1.B2 U1.1 U1.2 U2.10 U8.4
~A_EN: U1.8 U5.5 U6.5
~A_MODE1: U1.6 U1.9
~ASEL_BITS0: U6.15 U67.1 U68.1
~ASEL_BITS1: U6.14 U13.1 U30.1
~ASEL_BITS2: U6.13 U15.1 U31.1
~ASEL_BITS3: U6.12 U16.1 U32.1
~ASEL_BITS4: U6.11 U14.1 U33.1
~ASEL_BITS5: U6.10 U12.1 U34.1
~ASEL_BITS6: U6.9 U19.1 U35.1
~ASEL_BITS7: U6.7 U20.1 U36.1
~ASEL_BITS8: U5.15 U51.1 U52.1
~ASEL_BITS9: U5.14 U55.1 U56.1
~ASEL_BITS10: U5.13 U23.1 U39.1
~ASEL_BITS11: U5.12 U24.1 U40.1
~ASEL_BITS12: U5.11 U59.1 U60.1
~ASEL_BITS13: U5.10 U63.1 U64.1
~ASEL_BITS14: U5.9 U27.1 U43.1
~ASEL_BITS15: U5.7 U28.1 U44.1
~B_EN: CN1.B8 U3.5 U4.5
~BSEL_BITS0: U4.15 U71.1 U72.1
~BSEL_BITS1: U4.14 U17.1 U18.1
~BSEL_BITS2: U4.13 U21.1 U22.1
~BSEL_BITS3: U4.12 U25.1 U26.1
~BSEL_BITS4: U4.11 U11.1 U29.1
~BSEL_BITS5: U4.10 U47.1 U48.1
~BSEL_BITS6: U4.9 U37.1 U38.1
~BSEL_BITS7: U4.7 U41.1 U42.1
~BSEL_BITS8: U3.15 U45.1 U46.1
~BSEL_BITS9: U3.14 U49.1 U50.1
~BSEL_BITS10: U3.13 U53.1 U54.1
~BSEL_BITS11: U3.12 U57.1 U58.1
~BSEL_BITS12: U3.11 U61.1 U62.1
~BSEL_BITS13: U3.10 U65.1 U66.1
~BSEL_BITS14: U3.9 U69.1 U70.1
~BSEL_BITS15: U3.7 U73.1 U74.1
~D_SEL3: U1.3 U7.4
~LOAD_BITS1: U8.14 U13.11 U17.11 U18.11 U30.11
~LOAD_BITS2: U8.13 U15.11 U21.11 U22.11 U31.11
~LOAD_BITS3: U8.12 U16.11 U25.11 U26.11 U32.11
~LOAD_BITS4: U8.11 U11.11 U14.11 U29.11 U33.11
~LOAD_BITS5: U8.10 U12.11 U34.11 U47.11 U48.11
~LOAD_BITS6: U8.9 U19.11 U35.11 U37.11 U38.11
~LOAD_BITS7: U8.7 U20.11 U36.11 U41.11 U42.11
~LOAD_BITS8: U7.15 U45.11 U46.11 U51.11 U52.11
~LOAD_BITS9: U7.14 U49.11 U50.11 U55.11 U56.11
~LOAD_BITS10: U7.13 U23.11 U39.11 U53.11 U54.11
~LOAD_BITS11: U7.12 U24.11 U40.11 U57.11 U58.11
~LOAD_BITS12: U7.11 U59.11 U60.11 U61.11 U62.11
~LOAD_BITS13: U7.10 U63.11 U64.11 U65.11 U66.11
~LOAD_BITS14: U7.9 U27.11 U43.11 U69.11 U70.11
~LOAD_BITS15: U7.7 U28.11 U44.11 U73.11 U74.11
~LOAD_EN: U7.5 U8.5
~RESET: U67.11 U68.11 U71.11 U72.11

Pads without a net: CN1 A4 A5 A6 A7 A8 A9 A10 A11 A12 A13 A14 A15 A16 B10 B11 B13 B14 B16 B17 B19 B20 B22 B23 B25 B26 B28 B29 B31 B32 C10 C11 C12 C13 C14 C15 C16; U1 11; U8 15

## Via types
v1: diameter 0.4, hole 0.2, Top Layer to Bottom Layer, 1343 vias

## Routing (per net, layer and track width the routed paths; a pad name or vN(x,y) marks a point on that pad's centre or on a via; arc(x,y) is an arc through that point)
GND: length 935.4
  Top Layer w0.2: C32.2 v1(71,92.13) ; C63.2 v1(71,56.13) ; C33.2 v1(71,32.13) ; C26.2 v1(49,44.13) ; C20.2 v1(38,80.13) ; v1(40.5,20.13) 40.5,20.63 40.87,21 U58.10 ; C56.2 v1(49,68.13) ; v1(18.5,32.13) 18.5,32.63 18.87,33 U18.10 ; U71.2 U71.3 U71.4 U71.5 U71.6 U71.7 U71.8 U71.9 U71.10 7.87,45 7.5,44.63 v1(7.5,44.13) ; v1(18.5,44.13) 18.5,44.63 18.87,45 U17.10 ; v1(62.5,68.13) 62.5,68.63 62.87,69 U64.10 ; C75.2 v1(16,80.13) ; v1(40.5,68.13) 40.5,68.63 40.87,69 U24.10 ; U56.10 18.87,69 18.5,68.63 v1(18.5,68.13) ; U25.10 40.87,33 40.5,32.63 v1(40.5,32.13) ; U60.10 51.87,69 51.5,68.63 v1(51.5,68.13) ; v1(84.5,80.13) 84.5,80.63 84.87,81 U36.10 ; U34.10 62.87,81 62.5,80.63 v1(62.5,80.13) ; U29.10 51.87,33 51.5,32.63 v1(51.5,32.13) ; U32.10 40.87,81 40.5,80.63 v1(40.5,80.13) ; U57.10 40.87,9 40.5,8.63 v1(40.5,8.13) ; U63.10 62.87,57 62.5,56.63 v1(62.5,56.13) ; C51.2 v1(38,56.13) ; v1(18.5,92.13) 18.5,92.63 18.87,93 U13.10 ; U42.10 84.87,45 84.5,44.63 v1(84.5,44.13) ; U28.10 84.87,69 84.5,68.63 v1(84.5,68.13) ; U30.10 18.87,81 18.5,80.63 v1(18.5,80.13) ; U49.10 18.87,9 18.5,8.63 v1(18.5,8.13) ; C27.2 v1(60,80.13) ; C37.2 v1(82,32.13) ; v1(62.5,20.13) 62.5,20.63 62.87,21 U66.10 ; C39.2 v1(93,80.13) ; U61.10 51.87,9 51.5,8.63 v1(51.5,8.13) ; U15.10 29.87,93 29.5,92.63 v1(29.5,92.13) ; C43.2 v1(16,56.13) ; v1(62.5,32.13) 62.5,32.63 62.87,33 U48.10 ; U11.10 51.87,45 51.5,44.63 v1(51.5,44.13) ; C53.2 v1(38,8.13) ; v1(73.5,68.13) 73.5,68.63 73.87,69 U27.10 ; C67.2 v1(82,56.13) ; U70.10 73.87,21 73.5,20.63 v1(73.5,20.13) ; v1(7.5,80.13) 7.5,80.73 7.77,81 U67.10 ; v1(51.5,92.13) 51.5,92.63 51.87,93 U14.10 ; C62.2 v1(60,20.13) ; C35.2 v1(82,80.13) ; C14.2 v1(60,92.13) ; U72.2 U72.3 U72.4 U72.5 U72.6 U72.7 U72.8 U72.9 U72.10 7.87,33 7.5,32.63 v1(7.5,32.13) ; C40.2 v1(93,92.13) ; C54.2 v1(38,20.13) ; v1(62.5,8.13) 62.5,8.63 62.87,9 U65.10 ; C28.2 v1(27,80.13) ; C16.2 v1(49,92.13) ; C78.2 v1(16,44.13) ; C47.2 v1(27,56.13) ; U26.10 40.87,45 40.5,44.63 v1(40.5,44.13) ; v1(73.5,92.13) 73.5,92.63 73.87,93 U19.10 ; U22.10 29.87,45 29.5,44.63 v1(29.5,44.13) ; U44.10 84.87,57 84.5,56.63 v1(84.5,56.13) ; v1(73.5,80.13) 73.5,80.63 73.87,81 U35.10 ; U55.10 18.87,57 18.5,56.63 v1(18.5,56.13) ; v1(7.5,9.13) 7.63,9 U45.10 ; C36.2 v1(82,92.13) ; C29.2 v1(60,32.13) ; U40.10 40.87,57 40.5,56.63 v1(40.5,56.13) ; C45.2 v1(16,8.13) ; U33.10 51.87,81 51.5,80.63 v1(51.5,80.13) ; U46.10 7.87,21 7.5,20.63 v1(7.5,20.13) ; v1(73.5,8.13) 73.5,8.63 73.87,9 U69.10 ; v1(51.5,56.13) 51.5,56.63 51.87,57 U59.10 ; C58.2 v1(49,20.13) ; C68.2 v1(82,68.13) ; 8.08,81.63 U67.10 ; U67.10 U67.9 U67.8 U67.7 U67.6 U67.5 U67.4 U67.3 U67.2 ; U52.10 7.87,69 7.5,68.63 v1(7.5,68.13) ; U41.10 84.87,33 84.5,32.63 v1(84.5,32.13) ; v1(18.5,20.13) 18.5,20.63 18.87,21 U50.10 ; C13.2 v1(27,92.13) ; U54.10 29.87,21 29.5,20.63 v1(29.5,20.13) ; C74.2 v1(93,20.13) ; C72.2 v1(93,68.13) ; v1(73.5,56.13) 73.5,56.63 73.87,57 U43.10 ; C46.2 v1(16,20.13) ; U73.10 84.87,9 84.5,8.63 v1(84.5,8.13) ; v1(29.5,32.13) 29.5,32.63 29.87,33 U21.10 ; U68.2 U68.3 U68.4 U68.5 U68.6 U68.7 U68.8 U68.9 U68.10 8.08,91.64 v1(8.09,91.63) ; v1(29.5,80.13) 29.5,80.63 29.87,81 U31.10 ; v1(73.5,44.13) 73.5,44.63 73.87,45 U38.10 ; C73.2 v1(93,8.13) ; C69.2 v1(82,8.13) ; U20.10 85.07,92.7 v1(84.5,92.13) ; C44.2 v1(16,68.13) ; v1(29.5,56.13) 29.5,56.63 29.87,57 U39.10 ; v1(62.5,92.13) 62.5,92.63 62.87,93 U12.10 ; 8.08,57.63 U51.10 7.87,57 7.5,56.63 v1(7.5,56.13) ; v1(51.5,20.13) 51.5,20.63 51.87,21 U62.10 ; C80.2 v1(49,80.13) ; C49.2 v1(27,8.13) ; C17.2 v1(38,44.13) ; C48.2 v1(27,68.13) ; C57.2 v1(49,8.13) ; C52.2 v1(38,68.13) ; v1(40.5,92.13) 40.5,92.63 40.87,93 U16.10 ; v1(62.5,44.13) 62.5,44.63 62.87,45 U47.10 ; C61.2 v1(60,8.13) ; U23.10 29.87,69 29.5,68.63 v1(29.5,68.13) ; U74.10 84.87,21 84.5,20.63 v1(84.5,20.13) ; C79.2 v1(38,32.13) ; C64.2 v1(71,68.13) ; C31.2 v1(71,80.13) ; C50.2 v1(27,20.13) ; C34.2 v1(71,44.13) ; C38.2 v1(82,44.13) ; C19.2 v1(27,44.13) ; C76.2 v1(16,92.13) ; C66.2 v1(71,20.13) ; U37.10 73.87,33 73.5,32.63 v1(73.5,32.13) ; C30.2 v1(60,44.13) ; C71.2 v1(93,56.13) ; C18.2 v1(27,32.13) ; C41.2 v1(93,32.13) ; C70.2 v1(82,20.13) ; C55.2 v1(49,56.13) ; C15.2 v1(38,92.13) ; C60.2 v1(60,68.13) ; U53.10 29.87,9 29.5,8.63 v1(29.5,8.13) ; C25.2 v1(49,32.13) ; C77.2 v1(16,32.13) ; C42.2 v1(93,44.13) ; C59.2 v1(60,56.13) ; C65.2 v1(71,8.13)
  Bottom Layer w0.2: v1(7.5,20.13) v1(16,20.13) v1(18.5,20.13) v1(27,20.13) v1(29.5,20.13) 36.78,20.13 36.81,20.09 92.97,20.09 v1(93,20.13) 101.5,20.13 ; 101.5,8.13 v1(93,8.13) v1(84.5,8.13) v1(82,8.13) v1(73.5,8.13) v1(71,8.13) v1(62.5,8.13) v1(60,8.13) v1(51.5,8.13) v1(49,8.13) v1(40.5,8.13) v1(38,8.13) v1(29.5,8.13) v1(27,8.13) v1(18.5,8.13) v1(16,8.13) 8.5,8.13 v1(7.5,9.13) ; 101.5,44.13 v1(93,44.13) v1(84.5,44.13) v1(82,44.13) v1(73.5,44.13) v1(71,44.13) v1(62.5,44.13) v1(60,44.13) v1(51.5,44.13) v1(49,44.13) v1(40.5,44.13) v1(38,44.13) v1(29.5,44.13) v1(27,44.13) v1(18.5,44.13) v1(16,44.13) v1(7.5,44.13) ; v1(7.5,32.13) v1(16,32.13) v1(18.5,32.13) v1(27,32.13) v1(29.5,32.13) v1(38,32.13) v1(40.5,32.13) v1(49,32.13) v1(51.5,32.13) v1(60,32.13) v1(62.5,32.13) v1(71,32.13) v1(73.5,32.13) v1(82,32.13) v1(84.5,32.13) v1(93,32.13) 101.5,32.13 ; 101.5,92.13 v1(93,92.13) v1(84.5,92.13) v1(82,92.13) 76.52,92.13 76.51,92.14 73.51,92.14 v1(73.5,92.13) v1(71,92.13) v1(62.5,92.13) v1(60,92.13) v1(51.5,92.13) v1(49,92.13) v1(40.5,92.13) v1(38,92.13) v1(29.5,92.13) v1(27,92.13) v1(18.5,92.13) v1(16,92.13) 8.59,92.13 v1(8.09,91.63) ; 101.5,80.13 v1(93,80.13) v1(84.5,80.13) v1(82,80.13) v1(73.5,80.13) v1(71,80.13) v1(62.5,80.13) v1(60,80.13) v1(51.5,80.13) v1(49,80.13) v1(40.5,80.13) v1(38,80.13) v1(29.5,80.13) v1(27,80.13) v1(18.5,80.13) v1(16,80.13) v1(7.5,80.13) ; v1(7.5,68.13) v1(16,68.13) v1(18.5,68.13) v1(27,68.13) v1(29.5,68.13) v1(38,68.13) v1(40.5,68.13) v1(49,68.13) v1(51.5,68.13) v1(60,68.13) v1(62.5,68.13) v1(71,68.13) v1(73.5,68.13) v1(82,68.13) v1(84.5,68.13) v1(93,68.13) 101.5,68.13 ; v1(7.5,56.13) v1(16,56.13) v1(18.5,56.13) v1(27,56.13) v1(29.5,56.13) v1(38,56.13) v1(40.5,56.13) v1(49,56.13) v1(51.5,56.13) v1(60,56.13) v1(62.5,56.13) v1(71,56.13) v1(73.5,56.13) v1(82,56.13) v1(84.5,56.13) v1(93,56.13) 101.5,56.13
VCC: length 1191.9
  Top Layer w0.2: U70.20 81.13,15.26 82,16.13 C70.1 81.2,17.43 81,17.63 v1(81,20.55) ; U27.20 81.13,63.26 82,64.13 C68.1 81.2,65.43 81,65.63 v1(81,68.63) ; v1(59,56.63) 59,53.63 59.2,53.43 C59.1 60,52.13 59.13,51.26 U59.20 ; v1(37,68.63) 37,65.63 37.2,65.43 C52.1 38,64.13 37.13,63.26 U23.20 ; U71.20 15.13,39.26 16,40.13 C78.1 15.2,41.43 15,41.63 v1(15,44.63) ; v1(37,44.63) 37,41.63 37.2,41.43 C17.1 38,40.13 37.13,39.26 U22.20 ; v1(81,56.63) 81,53.63 81.2,53.43 C67.1 82,52.13 81.13,51.26 U43.20 ; v1(92,32.63) 92,29.63 92.2,29.43 C41.1 93,28.13 92.13,27.26 U41.20 ; U48.20 70.13,27.26 71,28.13 C33.1 70.2,29.43 70,29.63 v1(70,32.63) ; U69.20 81.13,3.26 82,4.13 C69.1 81.2,5.43 81,5.63 v1(81,8.63) ; v1(15,80.63) 15,77.63 15.2,77.43 C75.1 16,76.13 15.13,75.26 U67.20 ; v1(37,20.55) 37,17.63 37.2,17.43 C54.1 38,16.13 37.13,15.26 U54.20 ; U12.20 70.13,87.26 71,88.13 C32.1 70.2,89.43 70,89.63 v1(70,92.63) ; U45.20 15.13,3.26 16,4.13 C45.1 15.2,5.43 15,5.63 v1(15,8.63) ; v1(26,44.63) 26,41.63 26.2,41.43 C19.1 27,40.13 26.13,39.26 U17.20 ; v1(26,92.63) 26,89.63 26.2,89.43 C13.1 27,88.13 26.13,87.26 U13.20 ; U46.20 15.13,15.26 16,16.13 C46.1 15.2,17.43 15,17.63 v1(15,20.63) ; v1(48,68.63) 48,65.63 48.2,65.43 C56.1 49,64.13 48.13,63.26 U24.20 ; v1(26,20.63) 26,17.63 26.2,17.43 C50.1 27,16.13 26.13,15.26 U50.20 ; v1(59,20.55) 59,17.63 59.2,17.43 C62.1 60,16.13 59.13,15.26 U62.20 ; U60.20 59.13,63.26 60,64.13 C60.1 59.2,65.43 59,65.63 v1(59,68.63) ; U74.20 92.13,15.26 93,16.13 C74.1 92.2,17.43 92,17.63 92,20.55 ; v1(92,68.63) 92,65.63 92.2,65.43 C72.1 93,64.13 92.13,63.26 U28.20 ; U19.20 81.13,87.26 82,88.13 C36.1 81.2,89.43 81,89.63 v1(81,92.63) ; U21.20 37.13,27.26 38,28.13 C79.1 37.2,29.43 37,29.63 v1(37,32.63) ; U64.20 70.13,63.26 71,64.13 C64.1 70.2,65.43 70,65.63 v1(70,68.63) ; v1(37,8.63) 37,5.63 37.2,5.43 C53.1 38,4.13 37.13,3.26 U53.20 ; U47.20 70.13,39.26 71,40.13 C34.1 70.2,41.43 70,41.63 v1(70,44.63) ; U52.20 15.13,63.26 16,64.13 C44.1 15.2,65.43 15,65.63 v1(15,68.63) ; U33.20 59.13,75.26 60,76.13 C27.1 59.2,77.43 59,77.63 v1(59,80.63) ; U72.20 15.13,27.26 16,28.13 C77.1 15.2,29.43 15,29.63 v1(15,32.63) ; U15.20 37.13,87.26 38,88.13 C15.1 37.2,89.43 37,89.63 v1(37,92.63) ; U73.20 92.13,3.26 93,4.13 C73.1 92.2,5.43 92,5.63 v1(92,8.63) ; U63.20 70.13,51.26 71,52.13 C63.1 70.2,53.43 70,53.63 v1(70,56.63) ; v1(15,56.63) 15,53.63 15.2,53.43 C43.1 16,52.13 15.13,51.26 U51.20 ; v1(26,56.63) 26,53.63 26.2,53.43 C47.1 27,52.13 26.13,51.26 U55.20 ; v1(81,32.63) 81,29.63 81.2,29.43 C37.1 82,28.13 81.13,27.26 U37.20 ; v1(48,56.63) 48,53.63 48.2,53.43 C55.1 49,52.13 48.13,51.26 U40.20 ; U35.20 81.13,75.26 82,76.13 C35.1 81.2,77.43 81,77.63 v1(81,80.63) ; v1(92,92.63) 92,89.63 92.2,89.43 C40.1 93,88.13 92.13,87.26 U20.20 ; v1(81,44.63) 81,41.63 81.2,41.43 C38.1 82,40.13 81.13,39.26 U38.20 ; U31.20 37.13,75.26 38,76.13 C20.1 37.2,77.43 37,77.63 v1(37,80.63) ; U66.20 70.13,15.26 71,16.13 C66.1 70.2,17.43 70,17.63 v1(70,20.55) ; v1(15,92.63) 15,89.63 15.2,89.43 C76.1 16,88.13 15.13,87.26 U68.20 ; v1(92,80.63) 92,77.63 92.2,77.43 C39.1 93,76.13 92.13,75.26 U36.20 ; v1(26,8.63) 26,5.63 26.2,5.43 C49.1 27,4.13 26.13,3.26 U49.20 ; U29.20 59.13,27.26 60,28.13 C29.1 59.2,29.43 59,29.63 v1(59,32.63) ; v1(59,8.63) 59,5.63 59.2,5.43 C61.1 60,4.13 59.13,3.26 U61.20 ; v1(26,68.63) 26,65.63 26.2,65.43 C48.1 27,64.13 26.13,63.26 U56.20 ; U26.20 48.13,39.26 49,40.13 C26.1 48.2,41.43 48,41.63 v1(48,44.63) ; U18.20 26.13,27.26 27,28.13 C18.1 26.2,29.43 26,29.63 v1(26,32.63) ; U39.20 37.13,51.26 38,52.13 C51.1 37.2,53.43 37,53.63 v1(37,56.63) ; v1(48,32.63) 48,29.63 48.2,29.43 C25.1 49,28.13 48.13,27.26 U25.20 ; U58.20 48.13,15.26 49,16.13 C58.1 48.2,17.43 48,17.63 v1(48,20.55) ; U30.20 26.13,75.26 27,76.13 C28.1 26.2,77.43 26,77.63 v1(26,80.63) ; v1(70,8.63) 70,5.63 70.2,5.43 C65.1 71,4.13 70.13,3.26 U65.20 ; U34.20 70.13,75.26 71,76.13 C31.1 70.2,77.43 70,77.63 v1(70,80.63) ; U16.20 48.13,87.26 49,88.13 C16.1 48.2,89.43 48,89.63 v1(48,92.63) ; v1(92,56.63) 92,53.63 92.2,53.43 C71.1 93,52.13 92.13,51.26 U44.20 ; v1(92,44.63) 92,41.63 92.2,41.43 C42.1 93,40.13 92.13,39.26 U42.20 ; v1(48,8.63) 48,5.63 48.2,5.43 C57.1 49,4.13 48.13,3.26 U57.20 ; U14.20 59.13,87.26 60,88.13 C14.1 59.2,89.43 59,89.63 v1(59,92.63) ; U32.20 48.13,75.26 49,76.13 C80.1 48.2,77.43 48,77.63 v1(48,80.63) ; v1(59,44.63) 59,41.63 59.2,41.43 C30.1 60,40.13 59.13,39.26 U11.20
  Bottom Layer w0.2: 101.5,68.63 v1(92,68.63) v1(81,68.63) v1(70,68.63) v1(59,68.63) v1(48,68.63) v1(37,68.63) v1(26,68.63) v1(15,68.63) ; 101.5,80.63 v1(92,80.63) v1(81,80.63) v1(70,80.63) v1(59,80.63) v1(48,80.63) v1(37,80.63) v1(26,80.63) v1(15,80.63) ; v1(15,92.63) v1(26,92.63) v1(37,92.63) v1(48,92.63) v1(59,92.63) v1(70,92.63) v1(81,92.63) v1(92,92.63) 101.5,92.63 ; 101.5,44.63 v1(92,44.63) v1(81,44.63) v1(70,44.63) v1(59,44.63) v1(48,44.63) v1(37,44.63) v1(26,44.63) v1(15,44.63) ; v1(15,56.63) v1(26,56.63) v1(37,56.63) v1(48,56.63) v1(59,56.63) v1(70,56.63) v1(81,56.63) v1(92,56.63) 101.5,56.63 ; v1(15,32.63) v1(26,32.63) v1(37,32.63) v1(48,32.63) v1(59,32.63) v1(70,32.63) v1(81,32.63) v1(92,32.63) 101.5,32.63 ; 101.5,20.63 v1(92,20.63) v1(26,20.63) v1(15,20.63) ; 101.5,8.63 v1(92,8.63) v1(81,8.63) v1(70,8.63) v1(59,8.63) v1(48,8.63) v1(37,8.63) v1(26,8.63) v1(15,8.63)
A0: length 223.7
  Top Layer w0.2: v1(92,88.13) 91.5,88.63 90.5,88.63 90.28,88.4 U20.19 ; v1(81,64.13) 80.5,64.63 79.5,64.63 79.28,64.4 U27.19 ; v1(26,64.13) 25.5,64.63 24.5,64.63 24.28,64.4 U56.19 ; v1(59,88.13) 58.5,88.63 57.5,88.63 57.28,88.4 U14.19 ; U52.19 13.28,64.4 13.5,64.63 14.5,64.63 v1(15,64.13) ; v1(37,88.13) 36.5,88.63 35.5,88.63 35.28,88.4 U15.19 ; U23.19 35.28,64.4 35.5,64.63 36.5,64.63 v1(37,64.13) ; v1(81,88.13) 80.5,88.63 79.5,88.63 79.28,88.4 U19.19 ; v1(15,88.13) 14.5,88.63 13.5,88.63 13.28,88.4 U68.19 ; U60.19 57.28,64.4 57.5,64.63 58.5,64.63 v1(59,64.13) ; v1(48,88.13) 47.5,88.63 46.5,88.63 46.28,88.4 U16.19 ; U28.19 90.28,64.4 90.5,64.63 91.5,64.63 v1(92,64.13) ; v1(26,88.13) 25.5,88.63 24.5,88.63 24.28,88.4 U13.19 ; v1(70,88.13) 69.5,88.63 68.5,88.63 68.28,88.4 U12.19 ; U24.19 46.28,64.4 46.5,64.63 47.5,64.63 v1(48,64.13) ; U64.19 68.28,64.4 68.5,64.63 69.5,64.63 v1(70,64.13)
  Bottom Layer w0.2: v1(15,88.13) 23.42,88.13 23.42,88.12 59,88.12 ; v1(59,64.13) v1(70,64.13) v1(81,64.13) v1(92,64.13) 101.5,64.13 ; 70,88.12 59,88.12 v1(59,88.13) ; v1(70,88.13) v1(81,88.13) v1(92,88.13) 101.5,88.13 ; 59,64.13 23.42,64.13 23.42,64.13 v1(15,64.13)
A1: length 216.4
  Top Layer w0.2: U14.18 v1(56.62,88.63) ; U13.18 v1(23.62,88.63) ; U60.18 v1(56.62,64.63) ; U12.18 v1(67.62,88.63) ; U23.18 v1(34.62,64.63) ; U28.18 v1(89.62,64.63) ; U68.18 v1(12.62,88.63) ; U64.18 v1(67.62,64.63) ; U15.18 v1(34.62,88.63) ; U27.18 v1(78.62,64.63) ; U56.18 v1(23.62,64.63) ; U24.18 v1(45.62,64.63) ; U16.18 v1(45.62,88.63) ; U20.18 v1(89.62,88.63) ; U19.18 v1(78.62,88.63) ; U52.18 v1(12.62,64.63)
  Bottom Layer w0.2: 70.2,88.63 67.62,88.63 ; 70.2,88.63 70.2,88.62 61.21,88.62 61.21,88.63 58.2,88.63 ; 70.2,88.63 73.21,88.63 73.21,88.62 82.2,88.62 82.2,88.63 ; 101.5,88.63 v1(89.62,88.63) 89.62,88.63 82.2,88.63 ; 70.2,64.63 73.21,64.63 73.21,64.63 82.2,64.63 82.2,64.63 ; 70.2,64.63 67.62,64.63 ; 70.2,64.63 70.2,64.63 61.21,64.63 61.21,64.63 58.2,64.63 ; 82.2,88.63 78.62,88.63 ; 101.5,64.63 v1(89.62,64.63) 82.21,64.63 82.2,64.63 ; 58.2,64.63 56.62,64.63 ; 58.2,64.63 58.2,64.63 49.21,64.63 49.21,64.63 46.2,64.63 ; 46.2,88.63 46.21,88.62 37.21,88.62 37.21,88.63 34.21,88.63 34.21,88.62 26.21,88.62 26.21,88.63 23.21,88.63 23.21,88.62 15.21,88.62 15.21,88.63 12.63,88.63 v1(12.62,88.63) ; 46.2,88.63 45.62,88.63 ; 46.2,88.63 49.21,88.63 49.21,88.62 58.2,88.62 58.2,88.63 ; 58.2,88.63 56.62,88.63 ; 46.2,64.63 46.21,64.63 37.21,64.63 37.21,64.63 34.21,64.63 34.21,64.63 26.21,64.63 26.21,64.63 23.21,64.63 23.21,64.63 15.21,64.63 15.21,64.63 12.63,64.63 v1(12.62,64.63) ; 46.2,64.63 45.62,64.63 ; 78.62,64.63 82.2,64.63
A2: length 238.5
  Top Layer w0.2: U16.17 45,87.28 v1(45,89.13) ; U14.17 56,87.28 v1(56,89.13) ; v1(67,89.13) 67,87.28 U12.17 ; v1(56,65.13) 56,63.28 U60.17 ; v1(89,89.13) 89,87.28 U20.17 ; U13.17 23,87.28 v1(23,89.13) ; v1(12,65.13) 12,63.28 U52.17 ; U28.17 89,63.28 v1(89,65.13) ; v1(45,65.13) 45,63.28 U24.17 ; v1(67,65.13) 67,63.28 U64.17 ; v1(34,65.13) 34,63.28 U23.17 ; v1(34,89.13) 34,87.28 U15.17 ; v1(23,65.13) 23,63.28 U56.17 ; v1(78,89.13) 78,87.28 U19.17 ; U27.17 78,63.28 v1(78,65.13) ; U68.17 12,87.28 v1(12,89.13)
  Bottom Layer w0.2: 57.11,89.12 58.41,89.12 58.42,89.13 69.1,89.13 69.11,89.12 ; 57.11,89.12 57.11,89.13 46.42,89.13 46.41,89.12 45.11,89.12 ; 57.11,89.12 56,89.12 ; v1(12,65.13) 12.42,65.13 12.42,65.13 22.11,65.13 22.12,65.13 23.41,65.13 23.42,65.13 33.11,65.13 33.12,65.13 34.41,65.13 34.42,65.13 45.11,65.13 45.11,65.13 ; 93.12,89.12 89,89.12 v1(89,89.13) 93.12,89.13 ; 93.12,89.12 101.5,89.12 ; 93.12,89.12 93.12,89.13 ; 45.11,65.13 46.41,65.13 46.42,65.13 57.11,65.13 57.11,65.13 ; 45.11,65.13 45,65.13 ; 56,65.13 57.11,65.13 ; 57.11,65.13 58.41,65.13 58.42,65.13 69.1,65.13 69.11,65.13 ; 93.12,65.13 93.11,65.13 82.42,65.13 82.41,65.13 81.11,65.13 ; 93.12,65.13 v1(89,65.13) 89,65.13 93.12,65.13 ; 93.12,65.13 93.12,65.13 ; 67,89.12 69.11,89.12 ; 69.11,89.12 70.41,89.12 70.42,89.13 81.1,89.13 81.11,89.12 ; 93.12,89.13 93.11,89.13 82.42,89.13 82.41,89.12 81.11,89.12 ; 45,89.12 45.11,89.12 ; 45.11,89.12 45.11,89.13 34.42,89.13 34.41,89.12 33.12,89.12 33.11,89.13 23.42,89.13 23.41,89.12 22.12,89.12 22.11,89.13 12.42,89.13 12.42,89.13 v1(12,89.13) ; 78,65.13 81.11,65.13 ; 81.11,65.13 81.1,65.13 70.42,65.13 70.41,65.13 69.11,65.13 ; 93.12,65.13 101.5,65.13 ; 78,89.12 81.11,89.12 ; 69.11,65.13 67,65.13
A3: length 243.9
  Top Layer w0.2: U13.16 v1(22.33,89.63) ; U24.16 v1(44.33,65.63) ; U52.16 v1(11.33,65.63) ; U14.16 v1(55.33,89.63) ; U20.16 v1(88.32,89.63) ; U15.16 v1(33.33,89.63) ; U19.16 v1(77.32,89.63) ; U28.16 v1(88.32,65.63) ; U23.16 v1(33.33,65.63) ; U16.16 v1(44.33,89.63) ; U64.16 v1(66.32,65.63) ; U27.16 v1(77.32,65.63) ; U60.16 v1(55.33,65.63) ; U56.16 v1(22.33,65.63) ; U12.16 v1(66.32,89.63) ; U68.16 v1(11.33,89.63)
  Bottom Layer w0.2: 68.88,89.63 66.32,89.63 ; 68.88,89.63 70.21,89.63 70.21,89.62 80.88,89.62 80.88,89.63 ; 68.88,89.63 68.88,89.62 58.21,89.62 58.21,89.63 56.88,89.63 ; 80.88,65.63 82.21,65.63 82.21,65.63 92.88,65.63 92.88,65.63 ; 80.88,65.63 80.88,65.63 70.21,65.63 70.21,65.63 68.88,65.63 ; 80.88,65.63 77.32,65.63 ; 56.88,89.63 55.33,89.63 ; 56.88,89.63 56.88,89.62 46.21,89.62 46.21,89.63 44.88,89.63 ; 44.88,89.63 44.88,89.62 34.21,89.62 34.21,89.63 32.89,89.63 32.88,89.62 23.21,89.62 23.21,89.63 21.89,89.63 21.88,89.62 12.21,89.62 12.21,89.63 11.33,89.63 v1(11.33,89.63) ; 44.88,89.63 44.33,89.63 ; v1(88.32,89.63) 92.88,89.63 ; 92.88,89.63 101.5,89.63 ; 92.88,89.63 92.88,89.62 82.21,89.62 82.21,89.63 80.88,89.63 ; v1(88.32,65.63) 92.88,65.63 ; 92.88,65.63 101.5,65.63 ; 56.88,65.63 58.21,65.63 58.21,65.63 68.88,65.63 68.88,65.63 ; 56.88,65.63 55.33,65.63 ; 56.88,65.63 56.88,65.63 46.21,65.63 46.21,65.63 44.88,65.63 ; 80.88,89.63 77.32,89.63 ; 44.88,65.63 44.88,65.63 34.21,65.63 34.21,65.63 32.89,65.63 32.88,65.63 23.21,65.63 23.21,65.63 21.89,65.63 21.88,65.63 12.21,65.63 12.21,65.63 11.33,65.63 v1(11.33,65.63) ; 44.88,65.63 44.33,65.63 ; 68.88,65.63 66.32,65.63
A4: length 257.3
  Top Layer w0.2: U60.15 v1(54.67,66.13) ; U68.15 v1(10.67,90.13) ; U19.15 v1(76.68,90.13) ; U16.15 v1(43.67,90.13) ; U13.15 v1(21.67,90.13) ; U64.15 v1(65.68,66.13) ; U12.15 v1(65.68,90.13) ; U20.15 v1(87.68,90.13) ; U52.15 v1(10.67,66.13) ; U14.15 v1(54.67,90.13) ; U15.15 v1(32.67,90.13) ; U28.15 v1(87.68,66.13) ; U27.15 v1(76.68,66.13) ; U56.15 v1(21.67,66.13) ; U24.15 v1(43.67,66.13) ; U23.15 v1(32.67,66.13)
  Bottom Layer w0.2: 91.82,90.12 101.5,90.12 ; 91.82,90.12 91.81,90.13 ; 91.81,90.12 87.68,90.12 v1(87.68,90.13) 91.81,90.13 ; 55.81,66.13 57.11,66.13 57.12,66.13 67.81,66.13 67.81,66.13 ; 55.81,66.13 55.81,66.13 45.12,66.13 45.11,66.13 43.81,66.13 ; 55.81,66.13 54.67,66.13 ; 79.81,66.13 81.11,66.13 81.12,66.13 91.81,66.13 91.81,66.13 ; 79.81,66.13 76.68,66.13 ; 79.81,66.13 79.81,66.13 69.12,66.13 69.11,66.13 67.81,66.13 ; 79.81,90.12 81.11,90.12 81.12,90.13 91.81,90.13 91.81,90.13 ; 79.81,90.12 79.81,90.13 69.12,90.13 69.11,90.12 67.81,90.12 ; 79.81,90.12 76.68,90.12 ; 91.82,66.13 101.5,66.13 ; 91.81,66.13 87.68,66.13 v1(87.68,66.13) 91.81,66.13 ; 91.82,66.13 91.81,66.13 ; 43.81,90.12 45.11,90.12 45.12,90.13 55.81,90.13 55.81,90.12 ; 43.81,90.12 43.67,90.12 ; 43.81,90.12 43.81,90.13 33.12,90.13 33.11,90.12 31.82,90.12 31.81,90.13 22.12,90.13 22.11,90.12 20.82,90.12 20.81,90.13 11.12,90.13 11.11,90.13 v1(10.67,90.13) ; 67.81,90.12 67.81,90.13 57.12,90.13 57.11,90.12 55.81,90.12 ; 67.81,90.12 65.68,90.12 ; 54.67,90.12 55.81,90.12 ; 67.81,66.13 65.68,66.13 ; 43.81,66.13 43.81,66.13 33.12,66.13 33.11,66.13 31.82,66.13 31.81,66.13 22.12,66.13 22.11,66.13 20.82,66.13 20.81,66.13 11.12,66.13 11.11,66.13 v1(10.67,66.13) ; 43.81,66.13 43.67,66.13
A5: length 262.5
  Top Layer w0.2: U15.14 v1(32.03,90.63) ; U56.14 v1(21.03,66.63) ; U64.14 v1(65.03,66.63) ; U12.14 v1(65.03,90.63) ; U24.14 v1(43.03,66.63) ; U13.14 v1(21.03,90.63) ; U19.14 v1(76.03,90.63) ; U16.14 v1(43.03,90.63) ; U23.14 v1(32.03,66.63) ; U60.14 v1(54.03,66.63) ; U68.14 v1(10.03,90.63) ; U52.14 v1(10.03,66.63) ; U27.14 v1(76.03,66.63) ; U20.14 v1(87.03,90.63) ; U14.14 v1(54.03,90.63) ; U28.14 v1(87.03,66.63)
  Bottom Layer w0.2: 67.58,66.63 68.88,66.63 68.89,66.63 79.57,66.63 79.58,66.63 ; 67.58,66.63 65.03,66.63 ; 67.58,66.63 67.57,66.63 56.89,66.63 56.88,66.63 55.58,66.63 ; 43.58,90.63 43.03,90.63 ; 43.58,90.63 44.88,90.63 44.89,90.62 55.58,90.62 55.58,90.63 ; 43.58,90.63 43.58,90.62 32.89,90.62 32.88,90.63 31.59,90.63 31.58,90.62 21.89,90.62 21.88,90.63 20.59,90.63 20.58,90.62 10.89,90.62 10.88,90.63 10.03,90.63 v1(10.03,90.63) ; v1(87.03,66.63) 91.58,66.63 ; 91.58,66.63 91.58,66.63 80.89,66.63 80.88,66.63 79.58,66.63 ; 91.58,66.63 101.5,66.63 ; 79.58,66.63 76.03,66.63 ; 67.58,90.63 68.88,90.63 68.89,90.62 79.57,90.62 79.58,90.63 ; 67.58,90.63 65.03,90.63 ; 67.58,90.63 67.57,90.62 56.89,90.62 56.88,90.63 55.58,90.63 ; 91.58,90.63 91.58,90.62 80.89,90.62 80.88,90.63 79.58,90.63 ; 91.58,90.63 v1(87.03,90.63) ; 91.58,90.63 101.5,90.63 ; 43.58,66.63 44.88,66.63 44.89,66.63 55.58,66.63 55.58,66.63 ; 43.58,66.63 43.58,66.63 32.89,66.63 32.88,66.63 31.59,66.63 31.58,66.63 21.89,66.63 21.88,66.63 20.59,66.63 20.58,66.63 10.89,66.63 10.88,66.63 10.03,66.63 v1(10.03,66.63) ; 43.58,66.63 43.03,66.63 ; 55.58,90.63 54.03,90.63 ; 79.58,90.63 76.03,90.63 ; 55.58,66.63 54.03,66.63
A6: length 275.9
  Top Layer w0.2: U13.13 v1(20.38,91.13) ; U24.13 v1(42.38,67.13) ; U27.13 v1(75.38,67.13) ; U12.13 v1(64.38,91.13) ; U23.13 v1(31.38,67.13) ; U56.13 v1(20.38,67.13) ; U28.13 v1(86.38,67.13) ; U68.13 v1(9.38,91.13) ; U20.13 v1(86.38,91.13) ; U60.13 v1(53.38,67.13) ; U16.13 v1(42.38,91.13) ; U64.13 v1(64.38,67.13) ; U19.13 v1(75.38,91.13) ; U52.13 v1(9.38,67.13) ; U14.13 v1(53.38,91.13) ; U15.13 v1(31.38,91.13)
  Bottom Layer w0.2: 90.51,91.13 90.52,91.12 ; 90.51,91.13 90.51,91.13 79.82,91.13 79.81,91.12 78.51,91.12 ; 90.51,91.13 v1(86.38,91.13) 86.38,91.12 90.51,91.12 ; 90.52,91.12 101.5,91.12 ; 42.38,67.13 42.51,67.13 ; 42.51,67.13 42.51,67.13 31.82,67.13 31.81,67.13 30.52,67.13 30.51,67.13 20.82,67.13 20.81,67.13 19.52,67.13 19.51,67.13 9.82,67.13 9.81,67.13 v1(9.38,67.13) ; 42.51,67.13 43.81,67.13 43.82,67.13 54.51,67.13 54.51,67.13 ; 42.51,91.12 43.81,91.12 43.82,91.13 54.51,91.13 54.51,91.12 ; 42.51,91.12 42.51,91.13 31.82,91.13 31.81,91.12 30.52,91.12 30.51,91.13 20.82,91.13 20.81,91.12 19.52,91.12 19.51,91.13 9.82,91.13 9.81,91.13 v1(9.38,91.13) ; 42.51,91.12 42.38,91.12 ; 78.51,91.12 78.5,91.13 67.82,91.13 67.81,91.12 66.51,91.12 ; 78.51,91.12 75.38,91.12 ; 54.51,91.12 55.81,91.12 55.82,91.13 66.5,91.13 66.51,91.12 ; 54.51,91.12 53.38,91.12 ; 90.51,67.13 90.52,67.13 ; 90.51,67.13 90.51,67.13 79.82,67.13 79.81,67.13 78.51,67.13 ; 90.51,67.13 v1(86.38,67.13) 86.38,67.13 90.51,67.13 ; 90.52,67.13 101.5,67.13 ; 64.38,91.12 66.51,91.12 ; 78.51,67.13 78.5,67.13 67.82,67.13 67.81,67.13 66.51,67.13 ; 78.51,67.13 75.38,67.13 ; 66.51,67.13 66.5,67.13 55.82,67.13 55.81,67.13 54.51,67.13 ; 66.51,67.13 64.38,67.13 ; 54.51,67.13 53.38,67.13
A7: length 255.5
  Top Layer w0.2: U19.12 v1(74.72,91.63) ; U15.12 v1(30.72,91.63) ; U23.12 v1(30.72,67.63) ; U28.12 v1(85.72,67.63) ; U60.12 v1(52.72,67.63) ; U56.12 v1(19.72,67.63) ; U16.12 v1(41.72,91.63) ; U52.12 v1(8.72,67.63) ; U20.12 v1(85.72,91.63) ; U12.12 v1(63.72,91.63) ; U27.12 v1(74.72,67.63) ; U14.12 v1(52.72,91.63) ; U68.12 v1(8.72,91.63) ; U13.12 v1(19.72,91.63) ; U64.12 v1(63.72,67.63) ; U24.12 v1(41.72,67.63)
  Bottom Layer w0.2: v1(74.72,91.63) v1(85.72,91.63) 101.5,91.63 ; 63.72,67.63 9.17,67.63 9.17,67.63 v1(8.72,67.63) ; v1(41.72,91.63) 41.73,91.63 74.72,91.63 ; 101.5,67.63 v1(85.72,67.63) v1(74.72,67.63) v1(63.72,67.63) ; v1(8.72,91.63) 9.17,91.63 9.17,91.63 41.72,91.63
A8: length 229.4
  Top Layer w0.2: U43.19 79.28,52.4 79.5,52.63 80.5,52.63 v1(81,52.13) ; U51.19 13.28,52.4 13.5,52.63 14.5,52.63 v1(15,52.13) ; U40.19 46.28,52.4 46.5,52.63 47.5,52.63 v1(48,52.13) ; v1(26,76.13) 25.5,76.63 24.5,76.63 24.28,76.4 U30.19 ; v1(26,52.13) 25.5,52.63 24.5,52.63 24.28,52.4 U55.19 ; v1(81,76.13) 80.5,76.63 79.5,76.63 79.28,76.4 U35.19 ; U36.19 90.28,76.4 90.5,76.63 91.5,76.63 v1(92,76.13) ; U33.19 57.28,76.4 57.5,76.63 58.5,76.63 v1(59,76.13) ; v1(48,76.13) 47.5,76.63 46.5,76.63 46.28,76.4 U32.19 ; v1(59,52.13) 58.5,52.63 57.5,52.63 57.28,52.4 U59.19 ; U44.19 90.28,52.4 90.5,52.63 91.5,52.63 v1(92,52.13) ; v1(70,52.13) 69.5,52.63 68.5,52.63 68.28,52.4 U63.19 ; U39.19 35.28,52.4 35.5,52.63 36.5,52.63 v1(37,52.13) ; U31.19 35.28,76.4 35.5,76.63 36.5,76.63 v1(37,76.13) ; U34.19 68.28,76.4 68.5,76.63 69.5,76.63 v1(70,76.13) ; v1(15,76.13) 14.5,76.63 13.5,76.63 13.28,76.4 U67.19
  Bottom Layer w0.2: v1(15,52.13) 15,52.13 94.83,52.13 94.83,52.13 ; 94.84,76.13 101.5,76.13 ; 94.84,76.13 v1(92,76.13) ; 94.84,76.13 94.83,76.13 81,76.13 v1(81,76.13) v1(70,76.13) ; v1(15,76.13) 15,76.13 70,76.13 ; 94.83,52.13 v1(92,52.13) ; 94.83,52.13 101.5,52.13
A9: length 229.7
  Top Layer w0.2: U67.18 v1(12.62,76.63) ; U44.18 v1(89.62,52.63) ; U43.18 v1(78.62,52.63) ; U40.18 v1(45.62,52.63) ; U32.18 v1(45.62,76.63) ; U63.18 v1(67.62,52.63) ; U36.18 v1(89.62,76.63) ; U51.18 v1(12.62,52.63) ; U35.18 v1(78.62,76.63) ; U39.18 v1(34.62,52.63) ; U34.18 v1(67.62,76.63) ; U55.18 v1(23.62,52.63) ; U31.18 v1(34.62,76.63) ; U33.18 v1(56.62,76.63) ; U30.18 v1(23.62,76.63) ; U59.18 v1(56.62,52.63)
  Bottom Layer w0.2: 56.62,52.63 57.78,52.63 ; 57.78,52.63 60.79,52.63 60.79,52.63 69.78,52.63 69.78,52.63 ; 57.78,52.63 57.79,52.63 48.79,52.63 48.79,52.63 45.78,52.63 ; 69.78,76.63 69.78,76.63 60.79,76.63 60.79,76.63 57.78,76.63 ; 69.78,76.63 67.62,76.63 ; 69.78,76.63 72.79,76.63 72.79,76.63 81.78,76.63 81.78,76.63 ; 93.79,76.63 v1(89.62,76.63) 89.63,76.63 93.79,76.63 ; 93.79,76.63 93.79,76.63 101.5,76.63 ; 93.79,76.63 93.79,76.63 84.79,76.63 84.79,76.63 81.78,76.63 ; 45.62,52.63 45.78,52.63 ; 45.78,52.63 45.79,52.63 36.79,52.63 36.79,52.63 33.79,52.63 33.79,52.63 25.79,52.63 25.79,52.63 22.79,52.63 22.79,52.63 14.79,52.63 14.79,52.63 v1(12.62,52.63) ; v1(12.62,76.63) 14.79,76.63 14.79,76.63 22.79,76.63 22.79,76.63 25.79,76.63 25.79,76.63 33.79,76.63 33.79,76.63 36.79,76.63 36.79,76.63 45.79,76.63 45.78,76.63 ; 45.62,76.63 45.78,76.63 ; 45.78,76.63 48.79,76.63 48.79,76.63 57.79,76.63 57.78,76.63 ; 93.79,52.63 93.79,52.63 84.79,52.63 84.79,52.63 81.78,52.63 ; 93.79,52.63 93.79,52.63 101.5,52.63 ; 93.79,52.63 v1(89.62,52.63) 89.63,52.63 93.79,52.63 ; 81.78,52.63 81.78,52.63 72.79,52.63 72.79,52.63 69.78,52.63 ; 81.78,52.63 78.62,52.63 ; 69.78,52.63 67.62,52.63 ; 57.78,76.63 56.62,76.63 ; 81.78,76.63 78.62,76.63
A10: length 234.5
  Top Layer w0.2: v1(12,77.13) 12,75.28 U67.17 ; U31.17 34,75.28 v1(34,77.13) ; U36.17 89,75.28 v1(89,77.13) ; U63.17 67,51.28 v1(67,53.13) ; v1(78,77.13) 78,75.28 U35.17 ; U51.17 12,51.28 v1(12,53.13) ; U44.17 89,51.28 v1(89,53.13) ; v1(23,77.13) 23,75.28 U30.17 ; U34.17 67,75.28 v1(67,77.13) ; v1(45,53.13) 45,51.28 U40.17 ; v1(34,53.13) 34,51.28 U39.17 ; v1(78,53.13) 78,51.28 U43.17 ; U59.17 56,51.28 v1(56,53.13) ; U55.17 23,51.28 v1(23,53.13) ; v1(56,77.13) 56,75.28 U33.17 ; v1(45,77.13) 45,75.28 U32.17
  Bottom Layer w0.2: 69.53,77.13 67,77.13 ; 69.53,77.13 69.53,77.13 58.84,77.13 58.83,77.13 57.53,77.13 ; 69.53,77.13 70.83,77.13 70.84,77.13 81.53,77.13 81.53,77.13 ; 69.53,53.13 70.83,53.13 70.84,53.13 81.53,53.13 81.53,53.13 ; 69.53,53.13 69.53,53.13 58.84,53.13 58.83,53.13 57.53,53.13 ; 69.53,53.13 67,53.13 ; 45.53,77.13 45,77.13 ; 45.53,77.13 46.83,77.13 46.84,77.13 57.53,77.13 57.53,77.13 ; 45.53,77.13 45.53,77.13 34.84,77.13 34.83,77.13 33.54,77.13 33.53,77.13 23.84,77.13 23.83,77.13 22.54,77.13 22.53,77.13 12.84,77.13 12.83,77.13 12,77.13 v1(12,77.13) ; v1(89,53.13) 93.53,53.13 ; 93.53,53.13 101.5,53.13 ; 93.53,53.13 93.53,53.13 82.84,53.13 82.83,53.13 81.53,53.13 ; v1(12,53.13) 12,53.13 12.83,53.13 12.84,53.13 22.53,53.13 22.54,53.13 23.83,53.13 23.84,53.13 33.53,53.13 33.54,53.13 34.83,53.13 34.84,53.13 45.53,53.13 45.53,53.13 ; 45.53,53.13 46.83,53.13 46.84,53.13 57.53,53.13 57.53,53.13 ; 45.53,53.13 45,53.13 ; v1(89,77.13) 93.53,77.13 ; 93.53,77.13 93.53,77.13 82.84,77.13 82.83,77.13 81.53,77.13 ; 93.53,77.13 101.5,77.13 ; 81.53,77.13 78,77.13 ; 81.53,53.13 78,53.13 ; 57.53,53.13 56,53.13 ; 57.53,77.13 56,77.13
